# EAGLE design Stearns (EAGLE 6.6.0)
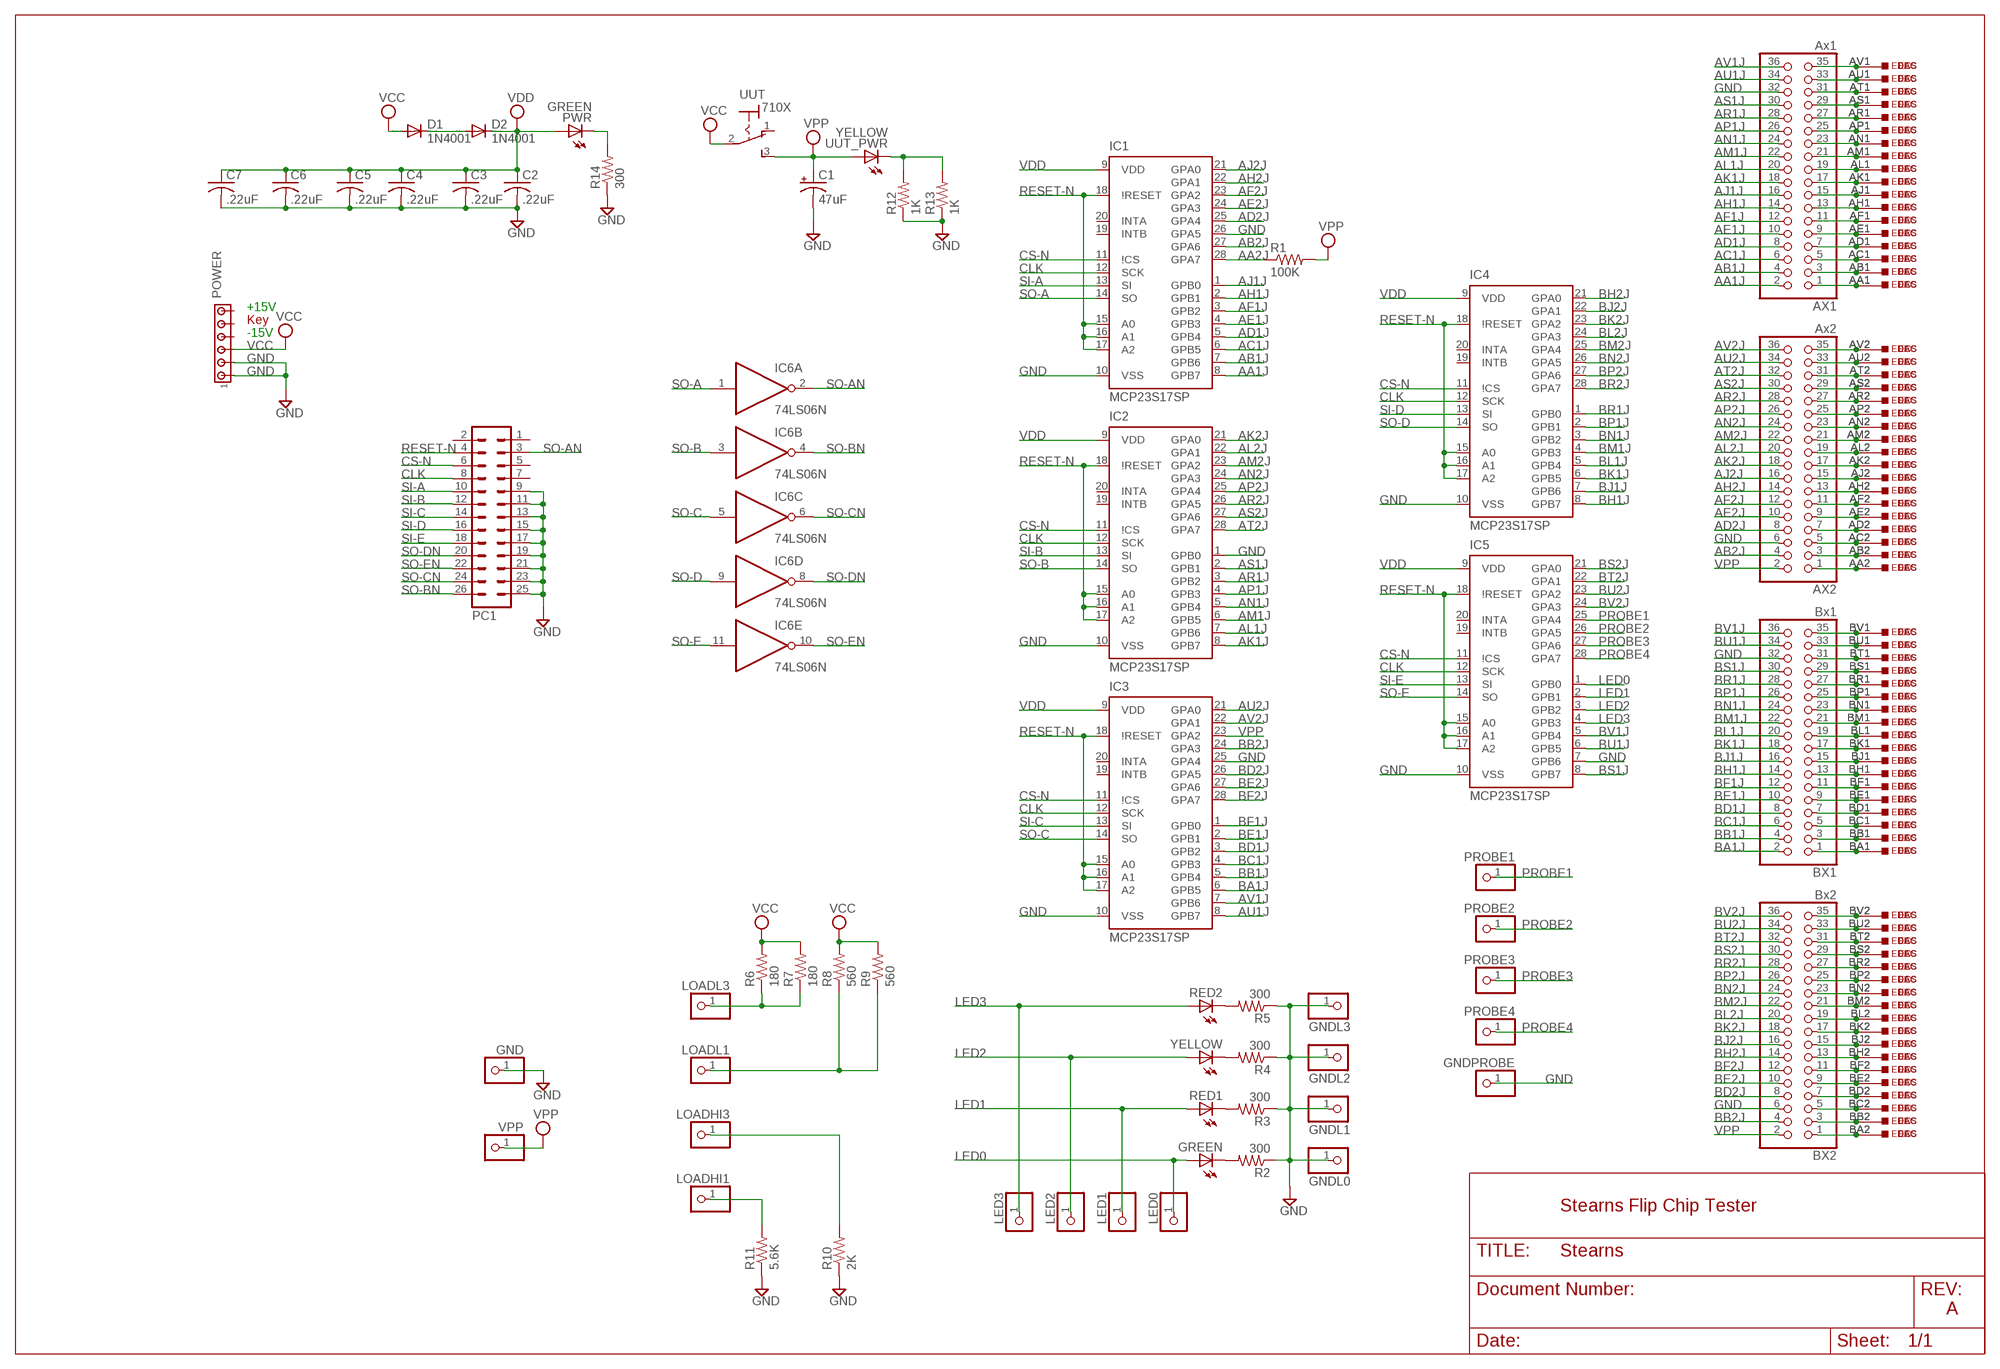
[diagram p0: schematic, sheet 1]

## Parts
AX1  Ax1  PINHD-2X18  [2X18]
AX2  Ax2  PINHD-2X18  [2X18]
BX1  Bx1  PINHD-2X18  [2X18]
BX2  Bx2  PINHD-2X18  [2X18]
C1  47uF  CPOL-USE5-8.5  [E5-8,5]
C2  .22uF  C-US050-025X075  [C050-025X075]
C3  .22uF  C-US050-025X075  [C050-025X075]
C4  .22uF  C-US050-025X075  [C050-025X075]
C5  .22uF  C-US050-025X075  [C050-025X075]
C6  .22uF  C-US050-025X075  [C050-025X075]
C7  .22uF  C-US050-025X075  [C050-025X075]
D1  1N4001  1N4004  [DO41-10]
D2  1N4001  1N4004  [DO41-10]
DEC  W971  [H807-2]
ECS  W971ECS  [ECS2418-2]
EDAC  W971EDAC  [EDAC346-36-2]
GND  PINHD-1X1  [1X01]
GNDL0  PINHD-1X1  [1X01]
GNDL1  PINHD-1X1  [1X01]
GNDL2  PINHD-1X1  [1X01]
GNDL3  PINHD-1X1  [1X01]
GNDPROBE  PINHD-1X1  [1X01]
GREEN  LED5MM  [LED5MM]
IC1  MCP23S17SP  [DIL28-3]
IC2  MCP23S17SP  [DIL28-3]
IC3  MCP23S17SP  [DIL28-3]
IC4  MCP23S17SP  [DIL28-3]
IC5  MCP23S17SP  [DIL28-3]
IC6  74LS06N  [DIL14]
LED0  PINHD-1X1  [1X01]
LED1  PINHD-1X1  [1X01]
LED2  PINHD-1X1  [1X01]
LED3  PINHD-1X1  [1X01]
LOADHI1  PINHD-1X1  [1X01]
LOADHI3  PINHD-1X1  [1X01]
LOADL1  PINHD-1X1  [1X01]
LOADL3  PINHD-1X1  [1X01]
PC1  MA13-2  [MA13-2]
POWER  MTA06-156  [1X6MTA]
PROBE1  PINHD-1X1  [1X01]
PROBE2  PINHD-1X1  [1X01]
PROBE3  PINHD-1X1  [1X01]
PROBE4  PINHD-1X1  [1X01]
PWR  GREEN  LED5MM  [LED5MM]
R1  100K  R-US_0207/10  [0207/10]
R2  300  R-US_0207/10  [0207/10]
R3  300  R-US_0207/10  [0207/10]
R4  300  R-US_0207/10  [0207/10]
R5  300  R-US_0207/10  [0207/10]
R6  180  R-US_0207/10  [0207/10]
R7  180  R-US_0207/10  [0207/10]
R8  560  R-US_0207/10  [0207/10]
R9  560  R-US_0207/10  [0207/10]
R10  2K  R-US_0207/10  [0207/10]
R11  5.6K  R-US_0207/10  [0207/10]
R12  1K  R-US_0207/10  [0207/10]
R13  1K  R-US_0207/10  [0207/10]
R14  300  R-US_0207/10  [0207/10]
RED1  LED5MM  [LED5MM]
RED2  LED5MM  [LED5MM]
UUT  710X  [7109MD9V3]
UUT_PWR  YELLOW  LED5MM  [LED5MM]
VPP  PINHD-1X1  [1X01]
YELLOW  LED5MM  [LED5MM]

## Nets
AA1J: AX1.2 IC1.8(GPB7)
AA2J: IC1.28(GPA7) R1.1
AB1J: AX1.4 IC1.7(GPB6)
AB2J: AX2.4 IC1.27(GPA6)
AC1J: AX1.6 IC1.6(GPB5)
AD1J: AX1.8 IC1.5(GPB4)
AD2J: AX2.8 IC1.25(GPA4)
AE1J: AX1.10 IC1.4(GPB3)
AE2J: AX2.10 IC1.24(GPA3)
AF1J: AX1.12 IC1.3(GPB2)
AF2J: AX2.12 IC1.23(GPA2)
AH1J: AX1.14 IC1.2(GPB1)
AH2J: AX2.14 IC1.22(GPA1)
AJ1J: AX1.16 IC1.1(GPB0)
AJ2J: AX2.16 IC1.21(GPA0)
AK1J: AX1.18 IC2.8(GPB7)
AK2J: AX2.18 IC2.21(GPA0)
AL1J: AX1.20 IC2.7(GPB6)
AL2J: AX2.20 IC2.22(GPA1)
AM1J: AX1.22 IC2.6(GPB5)
AM2J: AX2.22 IC2.23(GPA2)
AN1J: AX1.24 IC2.5(GPB4)
AN2J: AX2.24 IC2.24(GPA3)
AP1J: AX1.26 IC2.4(GPB3)
AP2J: AX2.26 IC2.25(GPA4)
AR1J: AX1.28 IC2.3(GPB2)
AR2J: AX2.28 IC2.26(GPA5)
AS1J: AX1.30 IC2.2(GPB1)
AS2J: AX2.30 IC2.27(GPA6)
AT2J: AX2.32 IC2.28(GPA7)
AU1J: AX1.34 IC3.8(GPB7)
AU2J: AX2.34 IC3.21(GPA0)
AV1J: AX1.36 IC3.7(GPB6)
AV2J: AX2.36 IC3.22(GPA1)
BA1J: BX1.2 IC3.6(GPB5)
BB1J: BX1.4 IC3.5(GPB4)
BB2J: BX2.4 IC3.24(GPA3)
BC1J: BX1.6 IC3.4(GPB3)
BD1J: BX1.8 IC3.3(GPB2)
BD2J: BX2.8 IC3.26(GPA5)
BE1J: BX1.10 IC3.2(GPB1)
BE2J: BX2.10 IC3.27(GPA6)
BF1J: BX1.12 IC3.1(GPB0)
BF2J: BX2.12 IC3.28(GPA7)
BH1J: BX1.14 IC4.8(GPB7)
BH2J: BX2.14 IC4.21(GPA0)
BJ1J: BX1.16 IC4.7(GPB6)
BJ2J: BX2.16 IC4.22(GPA1)
BK1J: BX1.18 IC4.6(GPB5)
BK2J: BX2.18 IC4.23(GPA2)
BL1J: BX1.20 IC4.5(GPB4)
BL2J: BX2.20 IC4.24(GPA3)
BM1J: BX1.22 IC4.4(GPB3)
BM2J: BX2.22 IC4.25(GPA4)
BN1J: BX1.24 IC4.3(GPB2)
BN2J: BX2.24 IC4.26(GPA5)
BP1J: BX1.26 IC4.2(GPB1)
BP2J: BX2.26 IC4.27(GPA6)
BR1J: BX1.28 IC4.1(GPB0)
BR2J: BX2.28 IC4.28(GPA7)
BS1J: BX1.30 IC5.8(GPB7)
BS2J: BX2.30 IC5.21(GPA0)
BT2J: BX2.32 IC5.22(GPA1)
BU1J: BX1.34 IC5.6(GPB5)
BU2J: BX2.34 IC5.23(GPA2)
BV1J: BX1.36 IC5.5(GPB4)
BV2J: BX2.36 IC5.24(GPA3)
CLK: IC1.12(SCK) IC2.12(SCK) IC3.12(SCK) IC4.12(SCK) IC5.12(SCK) PC1.8
CS-N: IC1.11(\!CS) IC2.11(\!CS) IC3.11(\!CS) IC4.11(\!CS) IC5.11(\!CS) PC1.6
GND [Supply]: AX1.32 AX2.6 BX1.32 BX2.6 C1.- C2.2 C3.2 C4.2 C5.2 C6.2 C7.2 GND.1 GNDL0.1 GNDL1.1 GNDL2.1 GNDL3.1 GNDPROBE.1 IC1.10(VSS) IC1.26(GPA5) IC2.1(GPB0) IC2.10(VSS) IC3.10(VSS) IC3.25(GPA4) IC4.10(VSS) IC5.7(GPB6) IC5.10(VSS) PC1.9 PC1.11 PC1.13 PC1.15 PC1.17 PC1.19 PC1.21 PC1.23 PC1.25 POWER.1 POWER.2 R2.1 R3.1 R4.1 R5.1 R10.1 R11.1 R12.1 R13.1 R14.1
LED0: GREEN.A IC5.1(GPB0) LED0.1
LED1: IC5.2(GPB1) LED1.1 RED1.A
LED2: IC5.3(GPB2) LED2.1 YELLOW.A
LED3: IC5.4(GPB3) LED3.1 RED2.A
N$1: AX1.1 DEC.AA1 ECS.AA1 EDAC.AA1
N$2: AX1.35 DEC.AV1 ECS.AV1 EDAC.AV1
N$3: AX1.33 DEC.AU1 ECS.AU1 EDAC.AU1
N$4: AX1.31 DEC.AT1 ECS.AT1 EDAC.AT1
N$5: AX1.29 DEC.AS1 ECS.AS1 EDAC.AS1
N$6: AX1.27 DEC.AR1 ECS.AR1 EDAC.AR1
N$7: AX1.25 DEC.AP1 ECS.AP1 EDAC.AP1
N$8: AX1.23 DEC.AN1 ECS.AN1 EDAC.AN1
N$9: AX1.21 DEC.AM1 ECS.AM1 EDAC.AM1
N$10: AX1.19 DEC.AL1 ECS.AL1 EDAC.AL1
N$11: AX1.17 DEC.AK1 ECS.AK1 EDAC.AK1
N$12: AX1.15 DEC.AJ1 ECS.AJ1 EDAC.AJ1
N$13: AX1.13 DEC.AH1 ECS.AH1 EDAC.AH1
N$14: AX1.11 DEC.AF1 ECS.AF1 EDAC.AF1
N$15: AX1.9 DEC.AE1 ECS.AE1 EDAC.AE1
N$16: AX1.7 DEC.AD1 ECS.AD1 EDAC.AD1
N$17: AX1.5 DEC.AC1 ECS.AC1 EDAC.AC1
N$18: AX1.3 DEC.AB1 ECS.AB1 EDAC.AB1
N$19: AX2.1 DEC.AA2 ECS.AA2 EDAC.AA2
N$20: AX2.3 DEC.AB2 ECS.AB2 EDAC.AB2
N$21: AX2.5 DEC.AC2 ECS.AC2 EDAC.AC2
N$22: AX2.7 DEC.AD2 ECS.AD2 EDAC.AD2
N$23: AX2.9 DEC.AE2 ECS.AE2 EDAC.AE2
N$24: AX2.11 DEC.AF2 ECS.AF2 EDAC.AF2
N$25: AX2.13 DEC.AH2 ECS.AH2 EDAC.AH2
N$26: AX2.15 DEC.AJ2 ECS.AJ2 EDAC.AJ2
N$27: AX2.17 DEC.AK2 ECS.AK2 EDAC.AK2
N$28: AX2.19 DEC.AL2 ECS.AL2 EDAC.AL2
N$29: AX2.21 DEC.AM2 ECS.AM2 EDAC.AM2
N$30: AX2.23 DEC.AN2 ECS.AN2 EDAC.AN2
N$31: AX2.25 DEC.AP2 ECS.AP2 EDAC.AP2
N$32: AX2.27 DEC.AR2 ECS.AR2 EDAC.AR2
N$33: AX2.29 DEC.AS2 ECS.AS2 EDAC.AS2
N$34: AX2.31 DEC.AT2 ECS.AT2 EDAC.AT2
N$35: AX2.33 DEC.AU2 ECS.AU2 EDAC.AU2
N$36: AX2.35 DEC.AV2 ECS.AV2 EDAC.AV2
N$37: BX2.1 DEC.BA2 ECS.BA2 EDAC.BA2
N$38: BX2.3 DEC.BB2 ECS.BB2 EDAC.BB2
N$39: BX2.5 DEC.BC2 ECS.BC2 EDAC.BC2
N$40: BX2.7 DEC.BD2 ECS.BD2 EDAC.BD2
N$41: BX2.9 DEC.BE2 ECS.BE2 EDAC.BE2
N$42: BX2.11 DEC.BF2 ECS.BF2 EDAC.BF2
N$43: BX2.13 DEC.BH2 ECS.BH2 EDAC.BH2
N$44: BX2.15 DEC.BJ2 ECS.BJ2 EDAC.BJ2
N$45: BX2.17 DEC.BK2 ECS.BK2 EDAC.BK2
N$46: BX2.19 DEC.BL2 ECS.BL2 EDAC.BL2
N$47: BX2.21 DEC.BM2 ECS.BM2 EDAC.BM2
N$48: BX2.23 DEC.BN2 ECS.BN2 EDAC.BN2
N$49: BX2.25 DEC.BP2 ECS.BP2 EDAC.BP2
N$50: BX2.27 DEC.BR2 ECS.BR2 EDAC.BR2
N$51: BX2.29 DEC.BS2 ECS.BS2 EDAC.BS2
N$52: BX2.31 DEC.BT2 ECS.BT2 EDAC.BT2
N$53: BX2.33 DEC.BU2 ECS.BU2 EDAC.BU2
N$54: BX2.35 DEC.BV2 ECS.BV2 EDAC.BV2
N$55: BX1.1 DEC.BA1 ECS.BA1 EDAC.BA1
N$56: BX1.3 DEC.BB1 ECS.BB1 EDAC.BB1
N$57: BX1.5 DEC.BC1 ECS.BC1 EDAC.BC1
N$58: BX1.7 DEC.BD1 ECS.BD1 EDAC.BD1
N$59: BX1.9 DEC.BE1 ECS.BE1 EDAC.BE1
N$60: BX1.11 DEC.BF1 ECS.BF1 EDAC.BF1
N$61: BX1.13 DEC.BH1 ECS.BH1 EDAC.BH1
N$62: BX1.15 DEC.BJ1 ECS.BJ1 EDAC.BJ1
N$63: BX1.17 DEC.BK1 ECS.BK1 EDAC.BK1
N$64: BX1.19 DEC.BL1 ECS.BL1 EDAC.BL1
N$65: BX1.21 DEC.BM1 ECS.BM1 EDAC.BM1
N$66: BX1.23 DEC.BN1 ECS.BN1 EDAC.BN1
N$67: BX1.25 DEC.BP1 ECS.BP1 EDAC.BP1
N$68: BX1.27 DEC.BR1 ECS.BR1 EDAC.BR1
N$69: BX1.29 DEC.BS1 ECS.BS1 EDAC.BS1
N$70: BX1.31 DEC.BT1 ECS.BT1 EDAC.BT1
N$71: BX1.33 DEC.BU1 ECS.BU1 EDAC.BU1
N$72: BX1.35 DEC.BV1 ECS.BV1 EDAC.BV1
N$73: GREEN.K(C) R2.2
N$74: R3.2 RED1.K(C)
N$75: R4.2 YELLOW.K(C)
N$76: R5.2 RED2.K(C)
N$77: LOADL3.1 R6.1 R7.1
N$78: LOADL1.1 R8.1 R9.1
N$79: LOADHI1.1 R11.2
N$80: LOADHI3.1 R10.2
N$81: D1.C D2.A
N$82: R12.2 R13.2 UUT_PWR.K(C)
N$83: PWR.K(C) R14.2
PROBE1: IC5.25(GPA4) PROBE1.1
PROBE2: IC5.26(GPA5) PROBE2.1
PROBE3: IC5.27(GPA6) PROBE3.1
PROBE4: IC5.28(GPA7) PROBE4.1
RESET-N: IC1.15(A0) IC1.16(A1) IC1.17(A2) IC1.18(\!RESET) IC2.15(A0) IC2.16(A1) IC2.17(A2) IC2.18(\!RESET) IC3.15(A0) IC3.16(A1) IC3.17(A2) IC3.18(\!RESET) IC4.15(A0) IC4.16(A1) IC4.17(A2) IC4.18(\!RESET) IC5.15(A0) IC5.16(A1) IC5.17(A2) IC5.18(\!RESET) PC1.4
SI-A: IC1.13(SI) PC1.10
SI-B: IC2.13(SI) PC1.12
SI-C: IC3.13(SI) PC1.14
SI-D: IC4.13(SI) PC1.16
SI-E: IC5.13(SI) PC1.18
SO-A: IC1.14(SO) IC6.1(A:I)
SO-AN: IC6.2(A:O) PC1.3
SO-B: IC2.14(SO) IC6.3(B:I)
SO-BN: IC6.4(B:O) PC1.26
SO-C: IC3.14(SO) IC6.5(C:I)
SO-CN: IC6.6(C:O) PC1.24
SO-D: IC4.14(SO) IC6.9(D:I)
SO-DN: IC6.8(D:O) PC1.20
SO-E: IC5.14(SO) IC6.11(E:I)
SO-EN: IC6.10(E:O) PC1.22
VCC [Supply]: D1.A POWER.3 R6.2 R7.2 R8.2 R9.2 UUT.2(P)
VDD [Supply]: C2.1 C3.1 C4.1 C5.1 C6.1 C7.1 D2.C IC1.9(VDD) IC2.9(VDD) IC3.9(VDD) IC4.9(VDD) IC5.9(VDD) PWR.A
VPP [Supply]: AX2.2 BX2.2 C1.+ IC3.23(GPA2) R1.2 UUT.3(S) UUT_PWR.A VPP.1
Unconnected: IC1.19(INTB) IC1.20(INTA) IC2.19(INTB) IC2.20(INTA) IC3.19(INTB) IC3.20(INTA) IC4.19(INTB) IC4.20(INTA) IC5.19(INTB) IC5.20(INTA) IC6.12(F:O) IC6.13(F:I) PC1.1 PC1.2 PC1.5 PC1.7 POWER.4 POWER.5 POWER.6 UUT.1(O)

## Notes on the sheet
- +15V
- Key
- -15V
- Stearns Flip Chip Tester
- A

## Power pins joined to a net without a drawn wire
GND: IC6.7(P:GND) UUT.NC@1(GND) UUT.NC@2(GND) UUT.NC@3(GND) UUT.NC@4(GND) UUT.NC@5(GND) UUT.NC@6(GND) UUT.NC@7(GND) UUT.NC@8(GND)
VCC: IC6.14(P:VCC)

## Library data of the parts
AX1 AX2 BX1 BX2 = pinhead:PINHD-2X18: PIN HEADER
C1 = rcl:CPOL-US: POLARIZED CAPACITOR, American symbol
C2-C7 = rcl:C-US: CAPACITOR, American symbol
D1 D2 = diode:1N4004: DIODE general purpose rectifier, 1 A
DEC ECS EDAC = dec-m:W971: Double sided Double Height Connector, 72 pins
GND GNDL0 GNDL1-GNDL3 GNDPROBE LED0 LED1-LED3 LOADHI1 LOADHI3 LOADL1 LOADL3 PROBE1-PROBE4 VPP = pinhead:PINHD-1X1: PIN HEADER
GREEN PWR RED1 RED2 UUT_PWR YELLOW = led:LED: LED OSRAM: - CHIPLED LG R971, LG N971, LY N971, LG Q971, LY Q971, LO R971, LY R971 LH N974, LH R974 LS Q976, LO Q976, LY Q976 LO Q996 - Hyper CHIPLED LW Q18S LB Q993, LB Q99A, LB R99A - SideLED LS A670, LO A670, LY A670, LG A670, LP A670 LB A673, LV A673, LT A673, LW A673 LH A674 LY A675 LS A676, LA A676, LO A676, LY A676, LW A676 LS A679, LY A679, LG A679 - Hyper Micro SIDELED® LS Y876, LA Y876, LO Y876, LY Y876 LT Y87S - SmartLED LW L88C, LW L88S LB L89C, LB L89S, LG L890 LS L89K, LO L89K, LY L89K LS L896, LA L896, LO L896, LY L896 - TOPLED LS T670, LO T670, LY T670, LG T670, LP T670 LSG T670, LSP T670, LSY T670, LOP T670, LYG T670 LG T671, LOG T671, LSG T671 LB T673, LV T673, LT T673, LW T673 LH T674 LS T676, LA T676, LO T676, LY T676, LB T676, LH T676, LSB T676, LW T676 LB T67C, LV T67C, LT T67C, LS T67K, LO T67K, LY T67K, LW E67C LS E67B, LA E67B, LO E67B, LY E67B, LB E67C, LV E67C, LT E67C LW T67C LS T679, LY T679, LG T679 LS T770, LO T770, LY T770, LG T770, LP T770 LB T773, LV T773, LT T773, LW T773 LH T774 LS E675, LA E675, LY E675, LS T675 LS T776, LA T776, LO T776, LY T776, LB T776 LHGB T686 LT T68C, LB T68C - Hyper Mini TOPLED® LB M676 - Mini TOPLED Santana® LG M470 LS M47K, LO M47K, LY M47K Source: http://www.osram.convergy.de LUXEON: - LUMILED® LXK2-PW12-R00, LXK2-PW12-S00, LXK2-PW14-U00, LXK2-PW14-V00 LXK2-PM12-R00, LXK2-PM12-S00, LXK2-PM14-U00 LXK2-PE12-Q00, LXK2-PE12-R00, LXK2-PE12-S00, LXK2-PE14-T00, LXK2-PE14-U00 LXK2-PB12-K00, LXK2-PB12-L00, LXK2-PB12-M00, LXK2-PB14-N00, LXK2-PB14-P00, LXK2-PB14-Q00 LXK2-PR12-L00, LXK2-PR12-M00, LXK2-PR14-Q00, LXK2-PR14-R00 LXK2-PD12-Q00, LXK2-PD12-R00, LXK2-PD12-S00 LXK2-PH12-R00, LXK2-PH12-S00 LXK2-PL12-P00, LXK2-PL12-Q00, LXK2-PL12-R00 Source: www.luxeon.com KINGBRIGHT: KA-3528ASYC Source: www.kingbright.com
IC1-IC5 = MCP23S17:MCP23S17: http://ww1.microchip.com/downloads/en/DeviceDoc/21952a.pdf Source: http://ww1.microchip.com/downloads/en/DeviceDoc/21952a.pdf
IC6 = 74xx-us:74*06: Hex INVERTER, open collector high-voltage output
PC1 = con-lstb:MA13-2: PIN HEADER; OC_FARNELL: unknown; OC_NEWARK: unknown
POWER = con-amp:MTA06-156: AMP connector
R1-R14 = rcl:R-US_: RESISTOR, American symbol
UUT = dec-con:710X: 710x with optional V2 or V3 mounting bracket.

## Net classes
1 Supply: width 0.813 mm

## Board
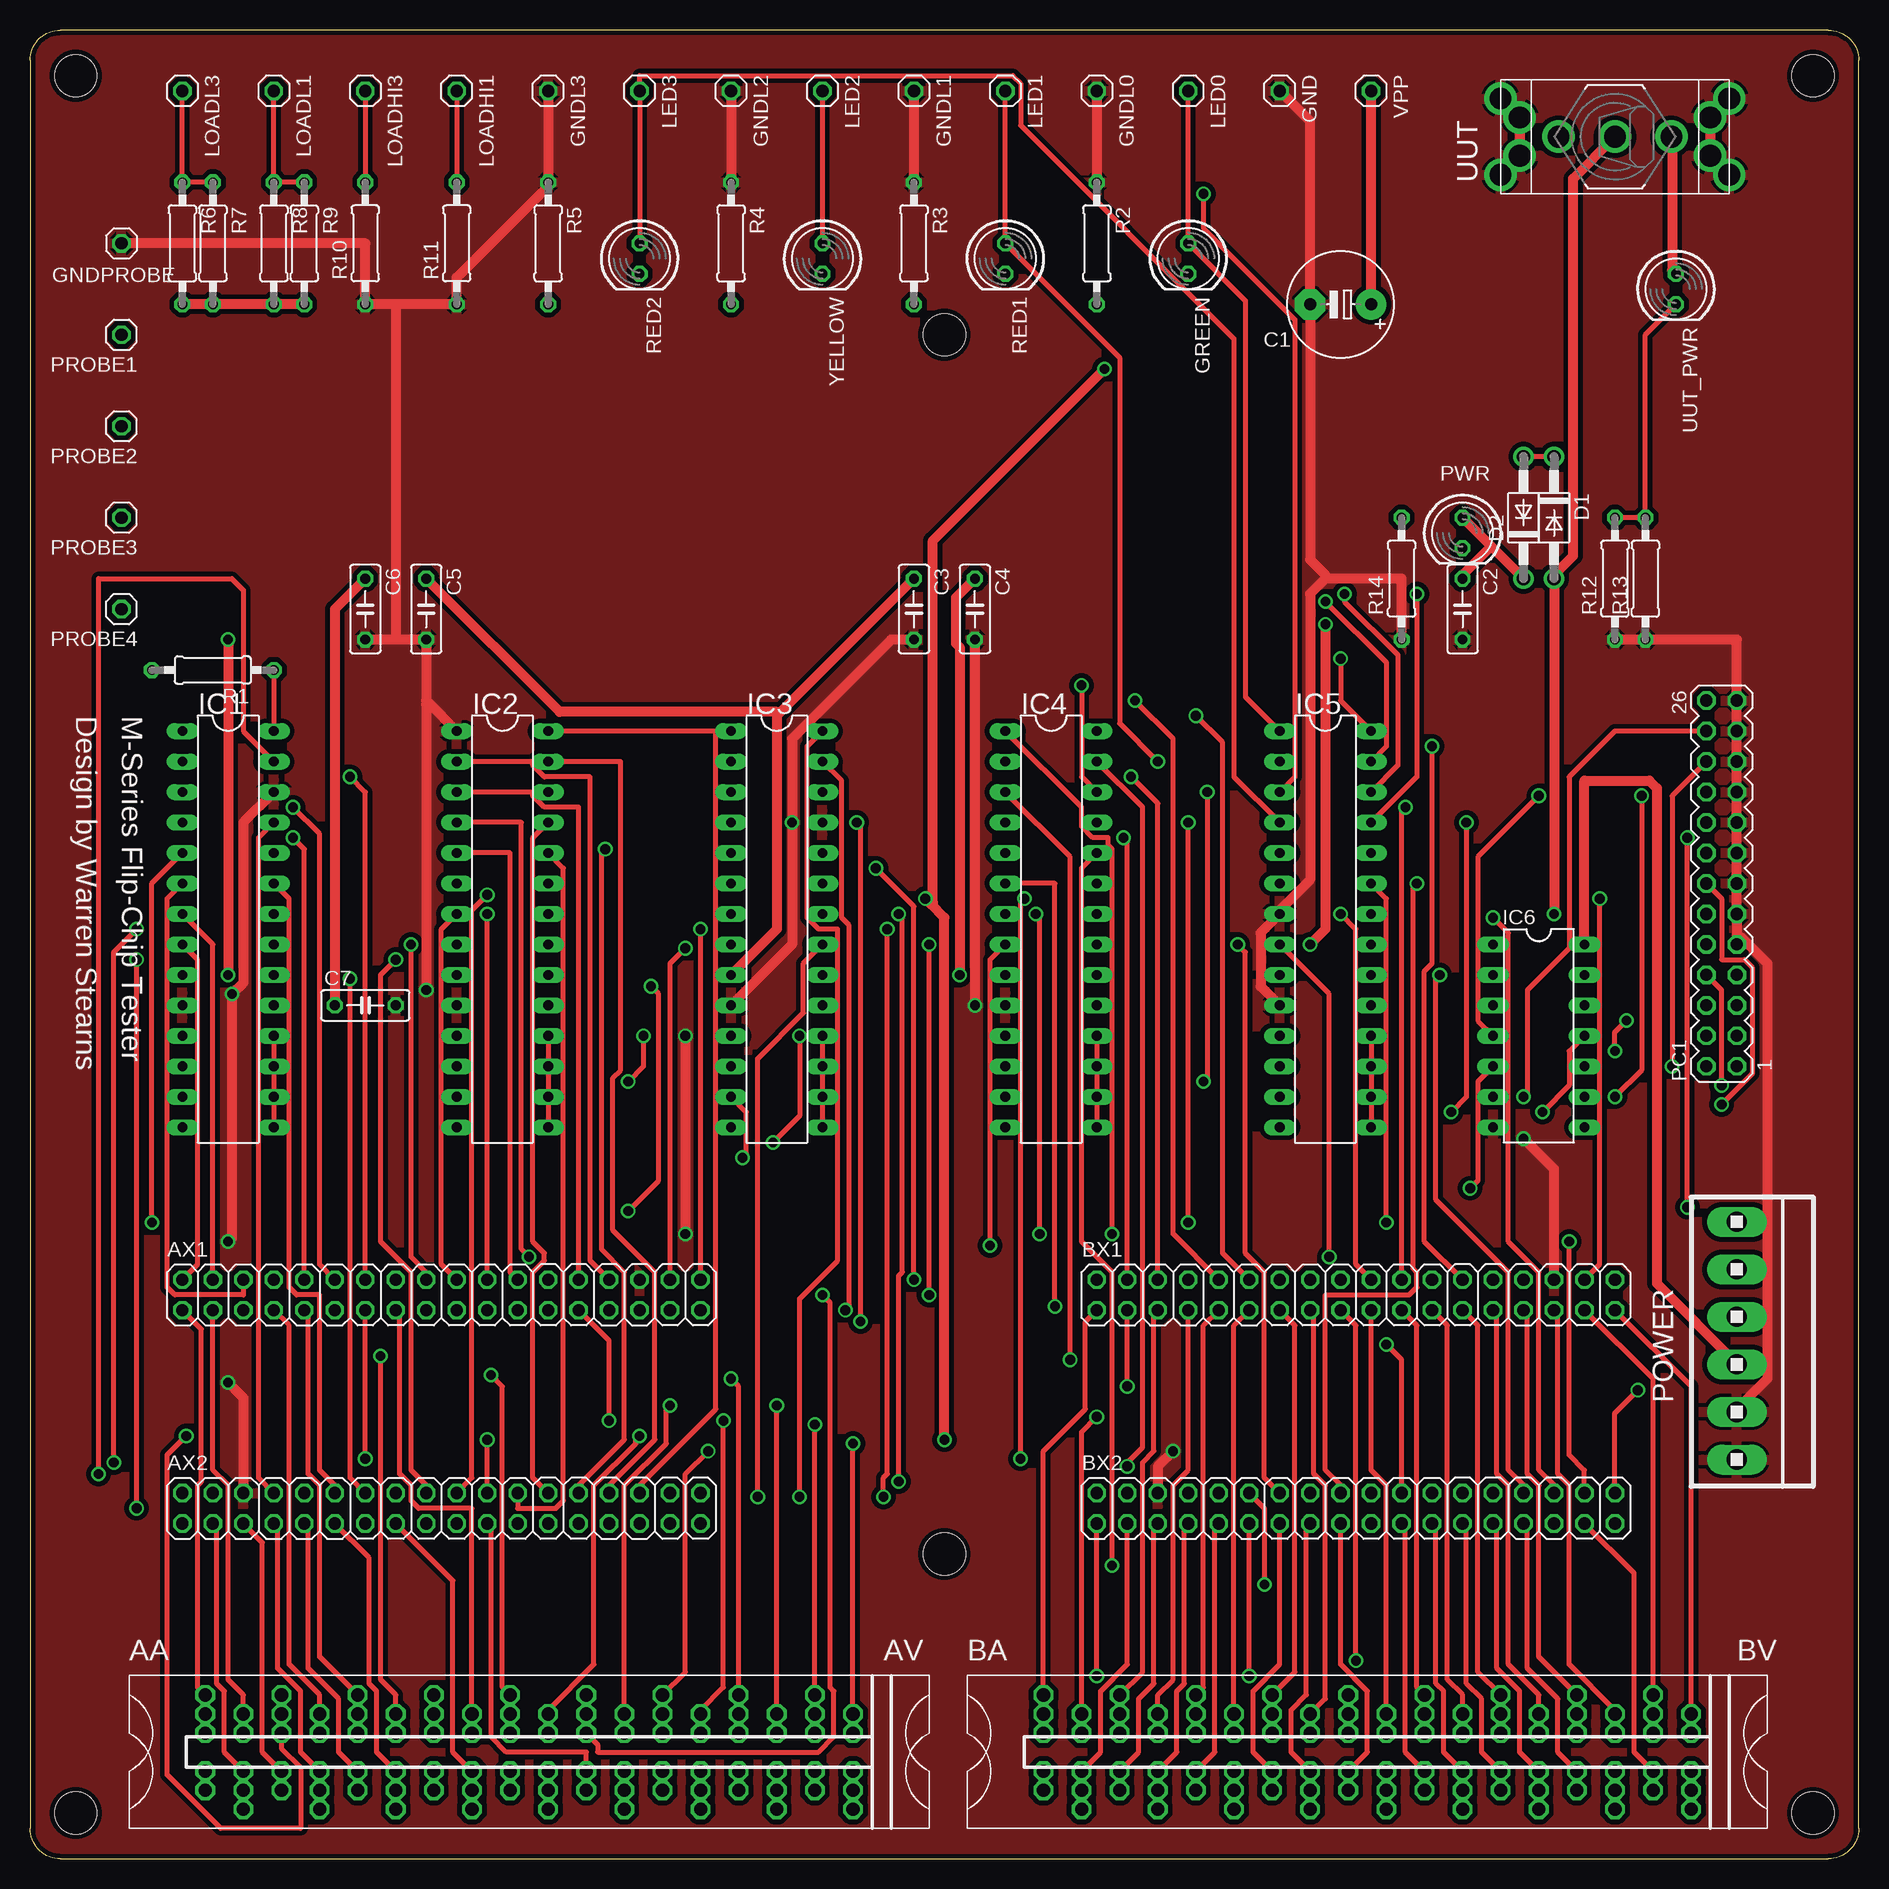
[diagram p1: board, top side]
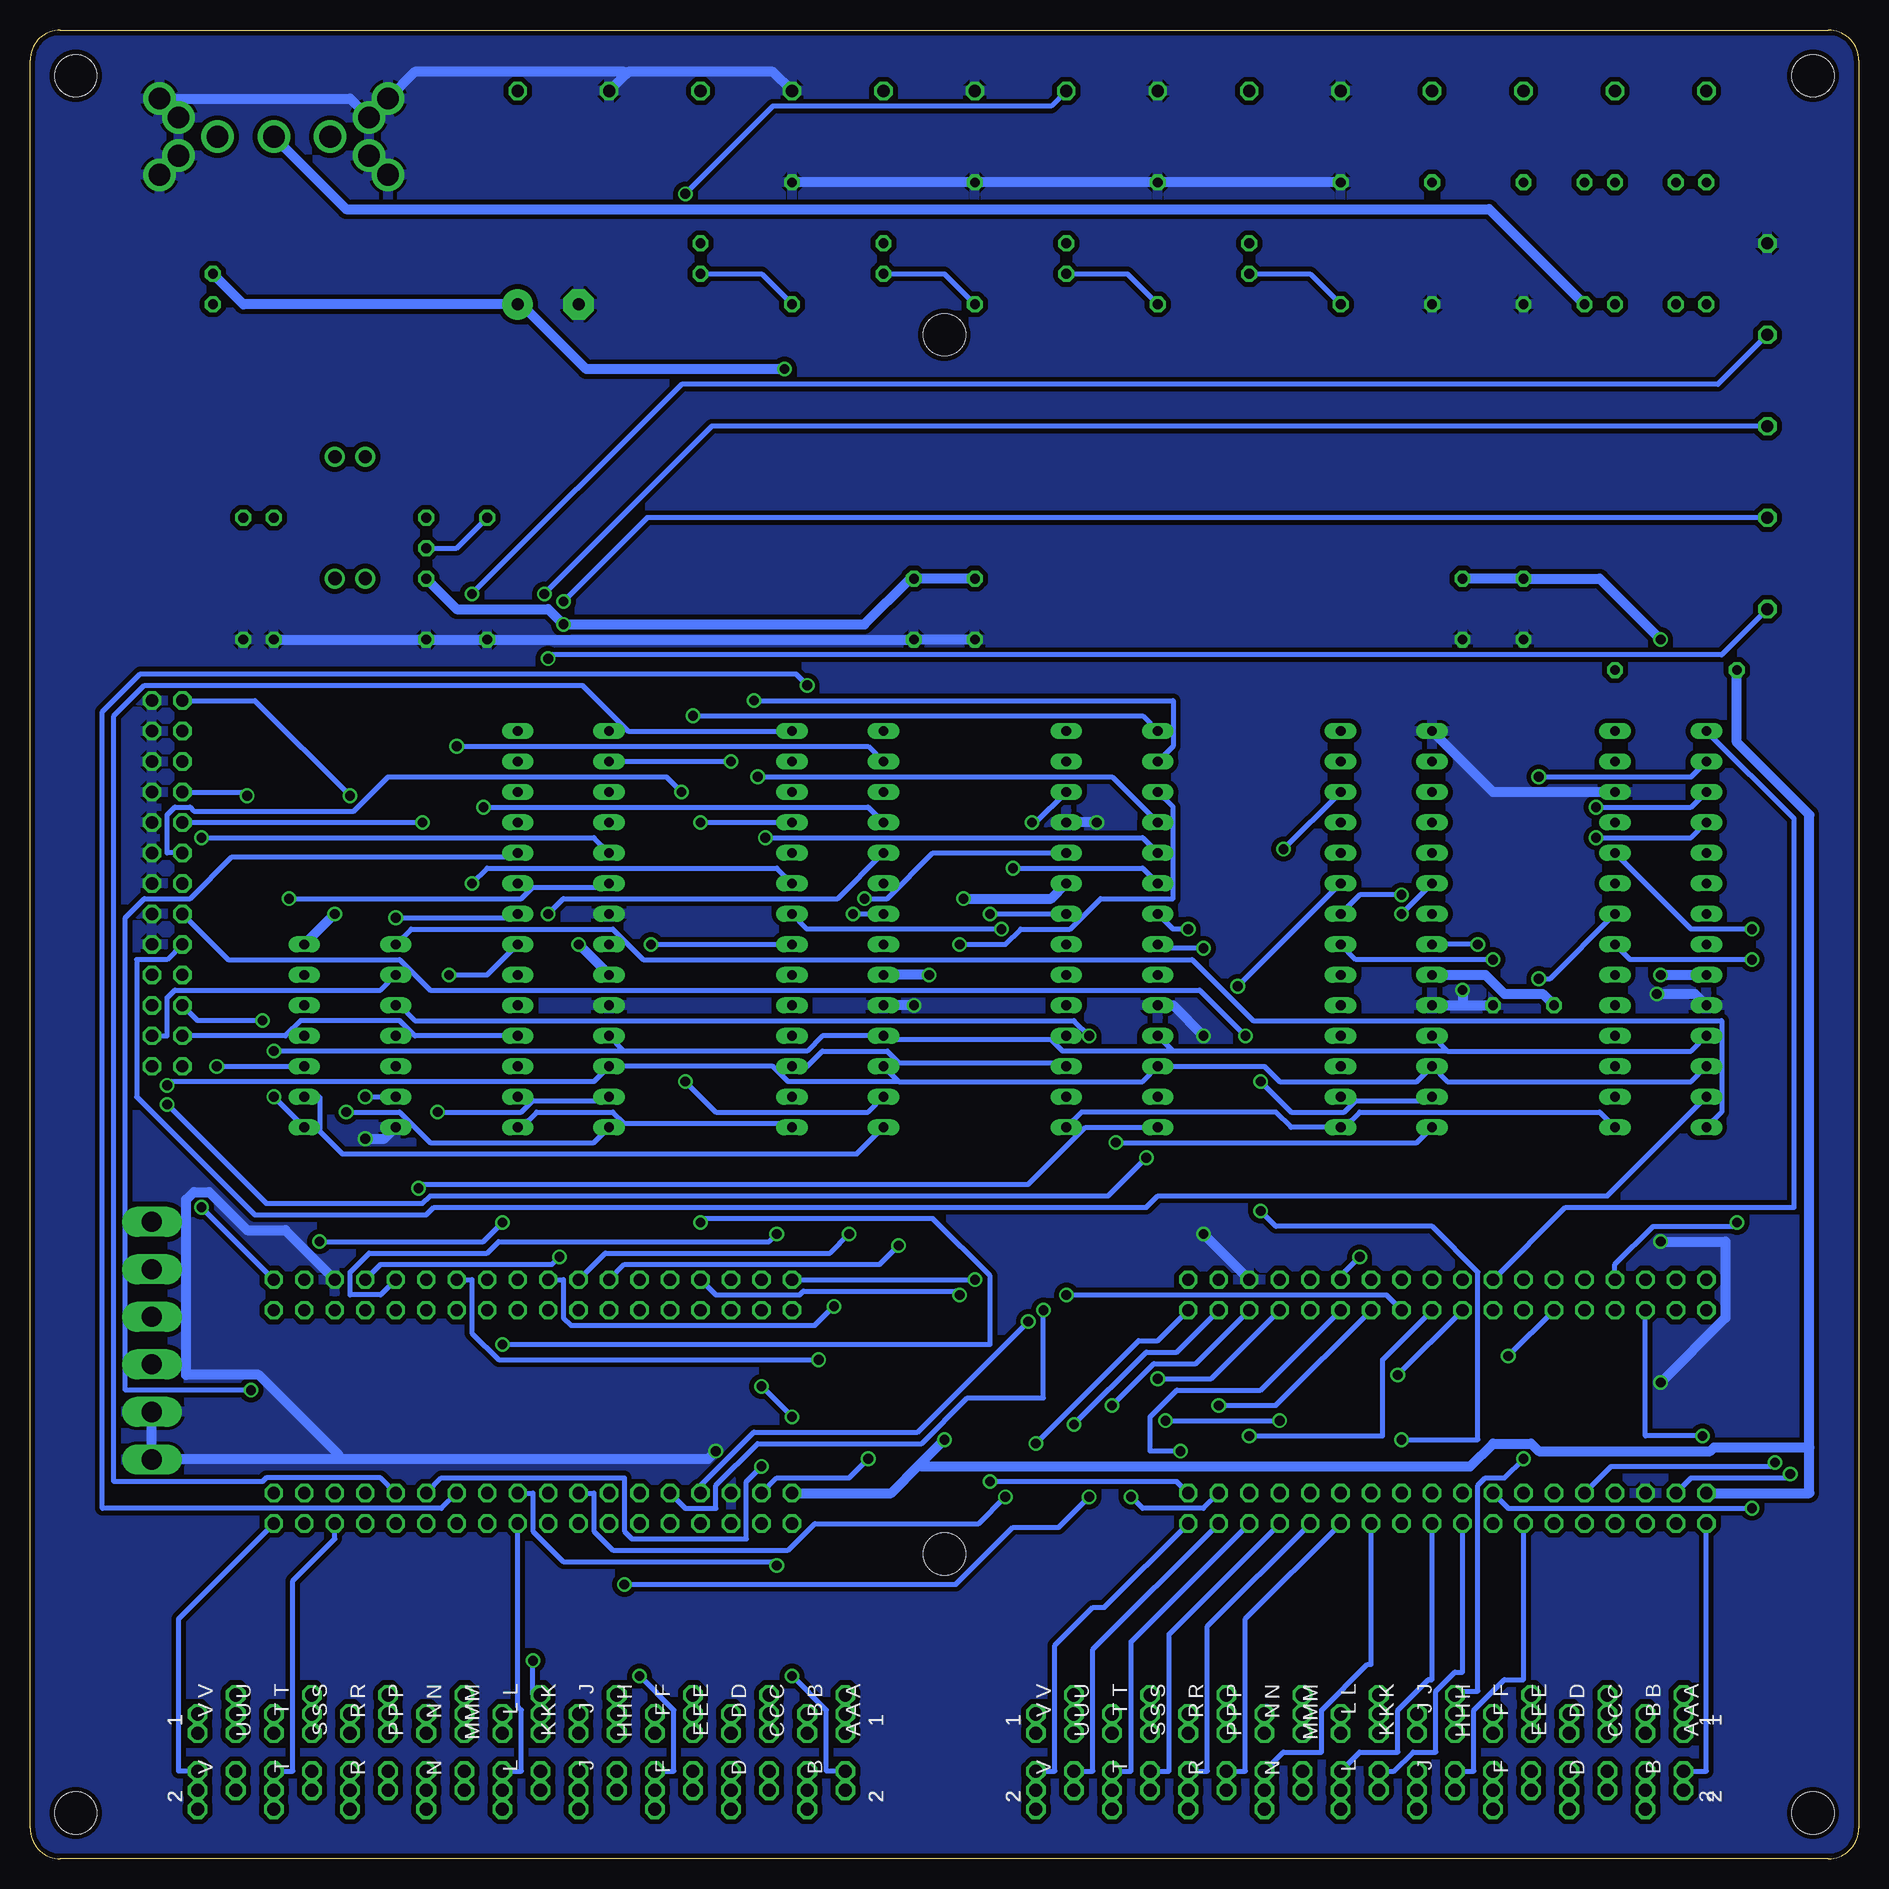
[diagram p2: board, bottom side, seen from below]

Size 152.4 x 152.4 mm. Coordinates in mm from the lower left corner, seen from the top.
Outline: 2.54,0 149.86,0 arc90 152.4,2.54 152.4,149.86 arc90 149.86,152.4 2.54,152.4 arc90 0,149.86 0,2.54 arc90 2.54,0
Copper layers (1+16): Top 0.035mm / dielectric 1.5mm / Bottom 0.035mm
Design rules "16mils *": minimum track width 16mil, minimum drill 32mil, track to track 15mil, track to pad 10mil, pad to pad 10mil, via to via 10mil, smd to smd 10mil, copper to edge 13mil, drill to drill 10mil, minimum pad ring 10mil, minimum via ring 8mil, stop-mask expansion 0mil, vias tented up to drill 0mil, thermal gap 10mil
Holes 3.51 mm at 3.81,3.81 148.59,3.81 148.59,148.59 3.81,148.59 76.2,25.4 76.2,127

### Footprints (pad centres in the part's own frame; a part is rotated, then mirrored left to right if it is on the bottom)
2X18 = drill 1.016 octagon: 1 -21.59,-1.27; 2 -21.59,1.27; 3 -19.05,-1.27; 4 -19.05,1.27; 5 -16.51,-1.27; 6 -16.51,1.27; 7 -13.97,-1.27; 8 -13.97,1.27; 9 -11.43,-1.27; 10 -11.43,1.27; 11 -8.89,-1.27; 12 -8.89,1.27; 13 -6.35,-1.27; 14 -6.35,1.27; 15 -3.81,-1.27; 16 -3.81,1.27; 17 -1.27,-1.27; 18 -1.27,1.27; 19 1.27,-1.27; 20 1.27,1.27; 21 3.81,-1.27; 22 3.81,1.27; 23 6.35,-1.27; 24 6.35,1.27; 25 8.89,-1.27; 26 8.89,1.27; 27 11.43,-1.27; 28 11.43,1.27; 29 13.97,-1.27; 30 13.97,1.27; 31 16.51,-1.27; 32 16.51,1.27; 33 19.05,-1.27; 34 19.05,1.27; 35 21.59,-1.27; 36 21.59,1.27
E5-8,5 = drill 1.016 pad 2.54: + -2.54,0 | drill 1.016 pad 2.54 octagon: - 2.54,0
C050-025X075 = drill 0.813 octagon: 1 -2.54,0; 2 2.54,0
DO41-10 = drill 1.118: A 5.08,0; C -5.08,0
H807-2 = drill 1.092 octagon: AA1 4.763,60.325; AA2 -1.587,60.325; AB1 1.587,57.15; AB2 -4.763,57.15; AC1 4.763,53.975; AC2 -1.587,53.975; AD1 1.587,50.8; AD2 -4.763,50.8; AE1 4.763,47.625; AE2 -1.587,47.625; AF1 1.587,44.45; AF2 -4.763,44.45; AH1 4.763,41.275; AH2 -1.587,41.275; AJ1 1.587,38.1; AJ2 -4.763,38.1; AK1 4.763,34.925; AK2 -1.587,34.925; AL1 1.587,31.75; AL2 -4.763,31.75; AM1 4.763,28.575; AM2 -1.587,28.575; AN1 1.587,25.4; AN2 -4.763,25.4; AP1 4.763,22.225; AP2 -1.587,22.225; AR1 1.587,19.05; AR2 -4.763,19.05; AS1 4.763,15.875; AS2 -1.587,15.875; AT1 1.587,12.7; AT2 -4.763,12.7; AU1 4.763,9.525; AU2 -1.587,9.525; AV1 1.587,6.35; AV2 -4.763,6.35; BA1 4.763,-9.525; BA2 -1.587,-9.525; BB1 1.587,-12.7; BB2 -4.763,-12.7; BC1 4.763,-15.875; BC2 -1.587,-15.875; BD1 1.587,-19.05; BD2 -4.763,-19.05; BE1 4.763,-22.225; BE2 -1.587,-22.225; BF1 1.587,-25.4; BF2 -4.763,-25.4; BH1 4.763,-28.575; BH2 -1.587,-28.575; BJ1 1.587,-31.75; BJ2 -4.763,-31.75; BK1 4.763,-34.925; BK2 -1.587,-34.925; BL1 1.587,-38.1; BL2 -4.763,-38.1; BM1 4.763,-41.275; BM2 -1.587,-41.275; BN1 1.587,-44.45; BN2 -4.763,-44.45; BP1 4.763,-47.625; BP2 -1.587,-47.625; BR1 1.587,-50.8; BR2 -4.763,-50.8; BS1 4.763,-53.975; BS2 -1.587,-53.975; BT1 1.587,-57.15; BT2 -4.763,-57.15; BU1 4.763,-60.325; BU2 -1.587,-60.325; BV1 1.587,-63.5; BV2 -4.763,-63.5
ECS2418-2 = drill 1.092 octagon: AA1 1.587,60.325; AA2 -1.587,60.325; AB1 1.587,57.15; AB2 -1.587,57.15; AC1 1.587,53.975; AC2 -1.587,53.975; AD1 1.587,50.8; AD2 -1.587,50.8; AE1 1.587,47.625; AE2 -1.587,47.625; AF1 1.587,44.45; AF2 -1.587,44.45; AH1 1.587,41.275; AH2 -1.587,41.275; AJ1 1.587,38.1; AJ2 -1.587,38.1; AK1 1.587,34.925; AK2 -1.587,34.925; AL1 1.587,31.75; AL2 -1.587,31.75; AM1 1.587,28.575; AM2 -1.587,28.575; AN1 1.587,25.4; AN2 -1.587,25.4; AP1 1.587,22.225; AP2 -1.587,22.225; AR1 1.587,19.05; AR2 -1.587,19.05; AS1 1.587,15.875; AS2 -1.587,15.875; AT1 1.587,12.7; AT2 -1.587,12.7; AU1 1.587,9.525; AU2 -1.587,9.525; AV1 1.587,6.35; AV2 -1.587,6.35; BA1 1.587,-9.525; BA2 -1.587,-9.525; BB1 1.587,-12.7; BB2 -1.587,-12.7; BC1 1.587,-15.875; BC2 -1.587,-15.875; BD1 1.587,-19.05; BD2 -1.587,-19.05; BE1 1.587,-22.225; BE2 -1.587,-22.225; BF1 1.587,-25.4; BF2 -1.587,-25.4; BH1 1.587,-28.575; BH2 -1.587,-28.575; BJ1 1.587,-31.75; BJ2 -1.587,-31.75; BK1 1.587,-34.925; BK2 -1.587,-34.925; BL1 1.587,-38.1; BL2 -1.587,-38.1; BM1 1.587,-41.275; BM2 -1.587,-41.275; BN1 1.587,-44.45; BN2 -1.587,-44.45; BP1 1.587,-47.625; BP2 -1.587,-47.625; BR1 1.587,-50.8; BR2 -1.587,-50.8; BS1 1.587,-53.975; BS2 -1.587,-53.975; BT1 1.587,-57.15; BT2 -1.587,-57.15; BU1 1.587,-60.325; BU2 -1.587,-60.325; BV1 1.587,-63.5; BV2 -1.587,-63.5
EDAC346-36-2 = drill 1.092 octagon: AA1 3.175,60.325; AA2 -3.175,60.325; AB1 3.175,57.15; AB2 -3.175,57.15; AC1 3.175,53.975; AC2 -3.175,53.975; AD1 3.175,50.8; AD2 -3.175,50.8; AE1 3.175,47.625; AE2 -3.175,47.625; AF1 3.175,44.45; AF2 -3.175,44.45; AH1 3.175,41.275; AH2 -3.175,41.275; AJ1 3.175,38.1; AJ2 -3.175,38.1; AK1 3.175,34.925; AK2 -3.175,34.925; AL1 3.175,31.75; AL2 -3.175,31.75; AM1 3.175,28.575; AM2 -3.175,28.575; AN1 3.175,25.4; AN2 -3.175,25.4; AP1 3.175,22.225; AP2 -3.175,22.225; AR1 3.175,19.05; AR2 -3.175,19.05; AS1 3.175,15.875; AS2 -3.175,15.875; AT1 3.175,12.7; AT2 -3.175,12.7; AU1 3.175,9.525; AU2 -3.175,9.525; AV1 3.175,6.35; AV2 -3.175,6.35; BA1 3.175,-9.525; BA2 -3.175,-9.525; BB1 3.175,-12.7; BB2 -3.175,-12.7; BC1 3.175,-15.875; BC2 -3.175,-15.875; BD1 3.175,-19.05; BD2 -3.175,-19.05; BE1 3.175,-22.225; BE2 -3.175,-22.225; BF1 3.175,-25.4; BF2 -3.175,-25.4; BH1 3.175,-28.575; BH2 -3.175,-28.575; BJ1 3.175,-31.75; BJ2 -3.175,-31.75; BK1 3.175,-34.925; BK2 -3.175,-34.925; BL1 3.175,-38.1; BL2 -3.175,-38.1; BM1 3.175,-41.275; BM2 -3.175,-41.275; BN1 3.175,-44.45; BN2 -3.175,-44.45; BP1 3.175,-47.625; BP2 -3.175,-47.625; BR1 3.175,-50.8; BR2 -3.175,-50.8; BS1 3.175,-53.975; BS2 -3.175,-53.975; BT1 3.175,-57.15; BT2 -3.175,-57.15; BU1 3.175,-60.325; BU2 -3.175,-60.325; BV1 3.175,-63.5; BV2 -3.175,-63.5
1X01 = drill 1.016 octagon: 1 0,0
LED5MM = drill 0.813 octagon: A -1.27,0; K 1.27,0
DIL28-3 = drill 0.813 long: 1 -16.51,-3.81; 2 -13.97,-3.81; 3 -11.43,-3.81; 4 -8.89,-3.81; 5 -6.35,-3.81; 6 -3.81,-3.81; 7 -1.27,-3.81; 8 1.27,-3.81; 9 3.81,-3.81; 10 6.35,-3.81; 11 8.89,-3.81; 12 11.43,-3.81; 13 13.97,-3.81; 14 16.51,-3.81; 15 16.51,3.81; 16 13.97,3.81; 17 11.43,3.81; 18 8.89,3.81; 19 6.35,3.81; 20 3.81,3.81; 21 1.27,3.81; 22 -1.27,3.81; 23 -3.81,3.81; 24 -6.35,3.81; 25 -8.89,3.81; 26 -11.43,3.81; 27 -13.97,3.81; 28 -16.51,3.81
DIL14 = drill 0.813 long: 1 -7.62,-3.81; 2 -5.08,-3.81; 3 -2.54,-3.81; 4 0,-3.81; 5 2.54,-3.81; 6 5.08,-3.81; 7 7.62,-3.81; 8 7.62,3.81; 9 5.08,3.81; 10 2.54,3.81; 11 0,3.81; 12 -2.54,3.81; 13 -5.08,3.81; 14 -7.62,3.81
MA13-2 = drill 1.016 octagon: 1 -15.24,-1.27; 2 -15.24,1.27; 3 -12.7,-1.27; 4 -12.7,1.27; 5 -10.16,-1.27; 6 -10.16,1.27; 7 -7.62,-1.27; 8 -7.62,1.27; 9 -5.08,-1.27; 10 -5.08,1.27; 11 -2.54,-1.27; 12 -2.54,1.27; 13 0,-1.27; 14 0,1.27; 15 2.54,-1.27; 16 2.54,1.27; 17 5.08,-1.27; 18 5.08,1.27; 19 7.62,-1.27; 20 7.62,1.27; 21 10.16,-1.27; 22 10.16,1.27; 23 12.7,-1.27; 24 12.7,1.27; 25 15.24,-1.27; 26 15.24,1.27
1X6MTA = drill 1.676 long: 1 9.906,0; 2 5.944,0; 3 1.981,0; 4 -1.981,0; 5 -5.944,0; 6 -9.906,0
0207/10 = drill 0.813 octagon: 1 -5.08,0; 2 5.08,0
7109MD9V3 = drill 1.803: 1 0,4.699; 2 0,0; 3 0,-4.699; NC@1 -3.175,9.525; NC@2 -1.587,7.938; NC@3 3.175,9.525; NC@4 1.587,7.938; NC@5 -3.175,-9.525; NC@6 -1.587,-7.938; NC@7 1.587,-7.938; NC@8 3.175,-9.525

### Placement (x,y rotation side)
AX1  34.29,46.99 0 top
AX2  34.29,29.21 0 top
BX1  110.49,46.99 0 top
BX2  110.49,29.21 0 top
C1  109.22,129.54 180 top
C2  119.38,104.14 270 top
C3  73.66,104.14 270 top
C4  78.74,104.14 270 top
C5  33.02,104.14 270 top
C6  27.94,104.14 270 top
C7  27.94,71.12 0 top
D1  127,111.76 270 top
D2  124.46,111.76 90 top
DEC  74.93,8.89 90 top
ECS  74.93,8.89 90 top
EDAC  74.93,8.89 90 top
GND  104.14,147.32 270 top
GNDL0  88.9,147.32 270 top
GNDL1  73.66,147.32 270 top
GNDL2  58.42,147.32 270 top
GNDL3  43.18,147.32 270 top
GNDPROBE  7.62,134.62 0 top
GREEN  96.52,133.35 270 top
IC1  16.51,77.47 270 top
IC2  39.37,77.47 270 top
IC3  62.23,77.47 270 top
IC4  85.09,77.47 270 top
IC5  107.95,77.47 270 top
IC6  125.73,68.58 270 top
LED0  96.52,147.32 270 top
LED1  81.28,147.32 270 top
LED2  66.04,147.32 270 top
LED3  50.8,147.32 270 top
LOADHI1  35.56,147.32 270 top
LOADHI3  27.94,147.32 270 top
LOADL1  20.32,147.32 270 top
LOADL3  12.7,147.32 270 top
PC1  140.97,81.28 90 top
POWER  142.24,43.18 270 top
PROBE1  7.62,127 180 top
PROBE2  7.62,119.38 180 top
PROBE3  7.62,111.76 180 top
PROBE4  7.62,104.14 180 top
PWR  119.38,110.49 270 top
R1  15.24,99.06 180 top
R2  88.9,134.62 270 top
R3  73.66,134.62 270 top
R4  58.42,134.62 270 top
R5  43.18,134.62 270 top
R6  12.7,134.62 270 top
R7  15.24,134.62 270 top
R8  20.32,134.62 270 top
R9  22.86,134.62 270 top
R10  27.94,134.62 90 top
R11  35.56,134.62 90 top
R12  132.08,106.68 90 top
R13  134.62,106.68 90 top
R14  114.3,106.68 90 top
RED1  81.28,133.35 270 top
RED2  50.8,133.35 270 top
UUT  132.08,143.51 90 top
UUT_PWR  137.16,130.81 270 top
VPP  111.76,147.32 270 top
YELLOW  66.04,133.35 270 top

### Tracks (layer width: path | path; a pad name or v marks a point on that pad's centre or on a via)
AA1J
  Top 0.406: IC1.8 13.97,74.93 13.97,49.53 AX1.2
AA2J
  Top 0.406: R1.1 IC1.28
AB1J
  Top 0.406: IC1.7 15.24,76.2 AX1.4
AB2J  (via drill 0.81)
  Top 0.406: IC1.27 17.78,93.98 17.78,105.73 16.83,106.68 5.71,106.68 v5.71,32.07
  Bottom 0.406: v5.71,32.07 6.03,31.75 13.97,31.75 AX2.4
AC1J
  Top 0.406: IC1.6 11.43,80.01 11.43,47.62 12.06,46.99 17.78,46.99 AX1.6
AD1J  (via drill 0.81)
  Top 0.406: IC1.5 10.16,81.28 v10.16,53.02
  Bottom 0.406: v10.16,53.02 10.48,52.7 17.14,52.7 20.32,49.53 AX1.8
AD2J
  Top 0.406: IC1.25 19.05,85.09 19.05,31.75 AX2.8
AE1J  (via drill 0.81)
  Top 0.406: v21.91,85.09 22.86,84.14 AX1.10
  Bottom 0.406: IC1.4 13.97,85.09 v21.91,85.09
AE2J  (via drill 0.81)
  Top 0.406: v8.89,77.47 6.99,75.56 v6.99,33.02
  Bottom 0.406: IC1.24 13.97,77.47 v8.89,77.47 | v6.99,33.02 7.3,32.7 20.64,32.7 AX2.10
AF1J  (via drill 0.81)
  Top 0.406: v21.91,87.63 24.13,85.41 24.13,49.53 AX1.12
  Bottom 0.406: IC1.3 13.97,87.63 v21.91,87.63
AF2J
  Top 0.406: IC1.23 21.59,80.01 21.59,47.62 22.23,46.99 24.13,46.99 24.13,32.38 25.4,31.11 AX2.12
AH1J  (via drill 0.81)
  Top 0.406: v26.67,90.17 27.94,88.9 AX1.14
  Bottom 0.406: IC1.2 13.97,90.17 v26.67,90.17
AH2J  (via drill 0.81)
  Top 0.406: v26.67,73.34 26.67,31.75 AX2.14
  Bottom 0.406: IC1.22 25.72,73.34 v26.67,73.34
AJ1J
  Bottom 0.406: IC1.1 5.4,86.68 5.4,54.29 24.45,54.29 AX1.16
AJ2J  (via drill 0.81)
  Top 0.406: v8.89,29.21 v8.89,74.93
  Bottom 0.406: IC1.21 19.05,74.93 v8.89,74.93 | v8.89,29.21 29.21,29.21 AX2.16
AK1J  (via drill 0.81)
  Top 0.406: v31.75,76.2 31.75,50.16 33.02,48.9 AX1.18
  Bottom 0.406: v31.75,76.2 IC2.8
AK2J  (via drill 0.81)
  Top 0.406: v30.48,74.93 29.21,73.66 29.21,51.44 31.75,48.9 31.75,32.38 33.02,31.11 AX2.18
  Bottom 0.406: IC2.21 41.91,74.93 v30.48,74.93
AL1J
  Top 0.406: IC2.7 34.29,77.47 34.29,49.53 AX1.20
AL2J  (via drill 0.81)
  Top 0.406: v38.1,80.33 36.83,79.06 36.83,31.75 AX2.20
  Bottom 0.406: IC2.22 41.59,80.33 v38.1,80.33
AM1J  (via drill 0.81)
  Top 0.406: AX1.22 v38.1,78.74
  Bottom 0.406: v38.1,78.74 IC2.6
AM2J  (via drill 0.81)
  Top 0.406: v51.75,72.71 52.39,72.07 52.39,56.52 v49.85,53.98 | AX2.22 v38.1,34.92
  Bottom 0.406: v51.75,72.71 IC2.23 | v49.85,53.98 48.58,52.7 35.56,52.7 31.75,48.9 31.75,34.92 v38.1,34.92
AN1J
  Top 0.406: IC2.5 40.01,83.82 40.01,48.9 AX1.24
AN2J
  Top 0.406: IC2.24 44.45,82.55 44.45,29.84 43.81,29.21 40.64,29.21 AX2.24
AP1J  (via drill 0.81)
  Top 0.406: IC2.4 40.96,86.36 40.96,50.8 v41.59,50.16
  Bottom 0.406: v41.59,50.16 43.18,48.58 AX1.26
AP2J
  Top 0.406: IC2.25 41.91,85.09 41.91,51.44 42.86,50.48 42.86,49.85 41.91,48.9 41.91,31.75 AX2.26
AR1J
  Top 0.406: IC2.3 41.91,88.9 41.91,88.58 42.86,87.63 45.72,87.63 AX1.28
AR2J  (via drill 0.81)
  Top 0.406: v47.94,84.14 47.62,83.82 47.62,50.8 49.53,48.9 49.53,34.92 45.72,31.11 AX2.28
  Bottom 0.406: v47.94,84.14 IC2.26
AS1J
  Top 0.406: IC2.2 41.91,91.44 41.91,91.12 42.86,90.17 46.67,90.17 46.67,49.85 AX1.30
AS2J
  Top 0.406: IC2.27 49.21,91.44 49.21,65.72 48.58,65.09 48.58,52.39 52.07,48.9 52.07,34.92 48.26,31.11 AX2.30
AT2J
  Top 0.406: IC2.28 57.15,93.98 57.15,37.47 50.8,31.11 AX2.32
AU1J  (via drill 0.81)
  Top 0.406: v54.61,75.88 53.34,74.61 AX1.34
  Bottom 0.406: IC3.8 58.1,75.88 v54.61,75.88
AU2J  (via drill 0.81)
  Top 0.406: IC3.21 64.45,74.61 64.45,70.48 60.64,66.67 v60.64,30.16
  Bottom 0.406: v60.64,30.16 59.69,29.21 54.61,29.21 AX2.34
AV1J  (via drill 0.81)
  Top 0.406: AX1.36 v55.88,77.47
  Bottom 0.406: IC3.7 57.15,77.47 v55.88,77.47
AV2J  (via drill 0.81)
  Top 0.406: v72.39,78.74 72.71,78.42 72.71,48.9 72.39,48.58 v72.39,31.43
  Bottom 0.406: v72.39,78.74 IC3.22 | v72.39,31.43 56.83,31.43 AX2.36
BA1J  (via drill 0.81)
  Top 0.406: v70.48,82.55 73.66,79.38 v73.66,48.26
  Bottom 0.406: IC3.6 59.69,82.55 v70.48,82.55 | BX1.2 v73.66,48.26
BB1J  (via drill 0.81)
  Top 0.406: v91.12,85.09 91.44,84.77 BX1.4
  Bottom 0.406: IC3.5 59.69,85.09 v91.12,85.09
BB2J  (via drill 0.81)
  Top 0.406: v82.87,80.01 82.55,79.69 v82.55,33.34
  Bottom 0.406: IC3.24 77.15,83.82 80.96,80.01 v82.87,80.01 | v82.55,33.34 84.14,31.75 90.17,31.75 BX2.4
BC1J  (via drill 0.81)
  Top 0.406: v91.76,90.17 93.98,87.95 BX1.6
  Bottom 0.406: IC3.4 62.23,90.17 v91.76,90.17
BD1J  (via drill 0.81)
  Top 0.406: v74.93,46.99 v74.93,76.2
  Bottom 0.406: IC3.3 57.15,87.63 57.15,80.01 63.18,80.01 65.72,77.47 69.85,77.47 71.12,76.2 v74.93,76.2 | v74.93,46.99 75.25,47.31 87.95,47.31 88.27,46.99 95.25,46.99 BX1.8
BD2J  (via drill 0.81)
  Top 0.406: v68.9,86.36 69.22,86.04 v69.22,44.77
  Bottom 0.406: IC3.26 68.58,86.36 v68.9,86.36 | v69.22,44.77 78.42,35.56 92.08,35.56 96.52,31.11 BX2.8
BE1J  (via drill 0.81)
  Top 0.406: v92.08,96.52 95.25,93.34 95.25,52.07 BX1.10
  Bottom 0.406: IC3.2 57.15,92.71 57.15,96.52 v92.08,96.52
BE2J  (via drill 0.81)
  Top 0.406: IC3.27 67.63,89.85 67.63,78.42 68.26,77.79 68.26,46.04 v67.94,45.72
  Bottom 0.406: v67.94,45.72 67.94,38.42 74.3,38.42 78.11,34.61 91.76,34.61 95.25,31.11 95.25,29.21 97.79,29.21 BX2.10
BF1J  (via drill 0.81)
  Top 0.406: v97.16,95.25 99.38,93.03 99.38,50.48 BX1.12
  Bottom 0.406: IC3.1 59.69,95.25 v97.16,95.25
BF2J  (via drill 0.81)
  Top 0.406: IC3.28 64.77,92.71 64.77,78.42 65.72,77.47 67.31,77.47 67.31,49.85 64.14,46.67 v64.14,30.16 | v102.87,22.86 102.87,29.21 BX2.12
  Bottom 0.406: v64.14,30.16 66.67,27.62 70.48,27.62 75.25,22.86 v102.87,22.86
BH1J  (via drill 0.81)
  Top 0.406: IC4.8 80.01,74.93 v80.01,51.12
  Bottom 0.406: v80.01,51.12 81.6,49.53 102.87,49.53 BX1.14
BH2J  (via drill 0.81)
  Top 0.406: v100.65,76.2 101.28,75.56 101.28,50.48 102.87,48.9 102.87,31.75 BX2.14
  Bottom 0.406: v100.65,76.2 IC4.21
BJ1J  (via drill 0.81)
  Top 0.406: v83.82,78.74 84.14,78.42 v84.14,52.07
  Bottom 0.406: v83.82,78.74 IC4.7 | v84.14,52.07 85.72,50.48 104.46,50.48 BX1.16
BJ2J  (via drill 0.81)
  Top 0.406: v71.44,77.47 71.44,32.07 71.12,31.75 v71.12,30.16
  Bottom 0.406: IC4.22 87.63,77.47 v71.44,77.47 | v71.12,30.16 73.34,27.94 87,27.94 89.22,25.72 103.82,25.72 105.41,27.3 105.41,30.48 BX2.16
BK1J  (via drill 0.81)
  Top 0.406: IC4.6 85.41,81.28 v85.41,46.04
  Bottom 0.406: v85.41,46.04 87,44.45 107.31,44.45 107.95,45.09 107.95,48.26 BX1.18
BK2J  (via drill 0.81)
  Top 0.406: v115.57,81.28 115.25,80.96 115.25,49.21 115.57,48.9 115.57,47.62 114.94,46.99 107.95,46.99 107.95,32.38 109.22,31.11 BX2.18
  Bottom 0.406: IC4.23 90.17,82.55 114.3,82.55 v115.57,81.28
BL1J  (via drill 0.81)
  Top 0.406: v109.22,78.74 110.49,77.47 110.49,49.53 BX1.20
  Bottom 0.406: IC4.5 85.09,80.01 107.95,80.01 v109.22,78.74
BL2J  (via drill 0.81)
  Top 0.406: IC4.24 87.63,82.55 87.63,51.44 90.17,48.9 v90.17,24.45
  Bottom 0.406: v90.17,24.45 90.49,24.77 107.95,24.77 110.49,27.3 110.49,30.48 BX2.20
BM1J  (via drill 0.81)
  Top 0.406: v114.62,87.63 114.3,87.31 BX1.22
  Bottom 0.406: IC4.4 82.55,87.63 v114.62,87.63
BM2J  (via drill 0.81)
  Top 0.406: v96.52,53.02 v96.52,86.36 | v113.03,42.86 114.3,41.59 BX2.22
  Bottom 0.406: v96.52,86.36 IC4.25 | v96.52,53.02 96.2,53.34 77.15,53.34 72.39,48.58 72.39,42.86 v113.03,42.86
BN1J  (via drill 0.81)
  Top 0.406: IC4.3 86.68,83.5 v86.68,41.59
  Bottom 0.406: v86.68,41.59 113.35,41.59 115.57,43.81 115.57,48.26 BX1.24
BN2J  (via drill 0.81)
  Top 0.406: IC4.26 87.63,90.17 v87.63,97.79
  Bottom 0.406: v87.63,97.79 88.58,98.74 143.19,98.74 146.37,95.57 146.37,29.21 118.11,29.21 BX2.24
BP1J  (via drill 0.81)
  Top 0.406: v116.84,92.71 116.84,74.61 116.2,73.98 116.2,51.44 BX1.26
  Bottom 0.406: IC4.2 82.55,92.71 v116.84,92.71
BP2J  (via drill 0.81)
  Top 0.406: IC4.27 92.71,87.63 92.71,34.29 91.44,33.02 v91.44,32.7
  Bottom 0.406: v91.44,32.7 92.71,31.43 92.71,26.67 102.23,26.67 102.87,27.3 102.87,31.75 118.11,31.75 BX2.26
BR1J  (via drill 0.81)
  Top 0.406: IC4.1 87.63,87.63 87.63,86.04 88.58,85.09 89.85,85.09 89.85,84.45 90.17,84.14 v90.17,52.07
  Bottom 0.406: v90.17,52.07 90.81,51.44 113.35,51.44 114.3,50.48 124.14,50.48 125.73,48.9 125.73,46.99 123.19,46.99 BX1.28
BR2J
  Bottom 0.406: IC4.28 102.55,93.98 106.36,97.79 142.88,97.79 145.41,95.25 145.41,31.43 133.03,31.43 132.72,31.75 123.19,31.75 BX2.28
BS1J  (via drill 0.81)
  Top 0.406: IC5.8 108.27,72.07 v108.27,50.16
  Bottom 0.406: v108.27,50.16 108.9,49.53 123.19,49.53 BX1.30
BS2J  (via drill 0.81)
  Top 0.406: v117.47,73.66 117.16,73.34 117.16,54.93 123.19,48.9 123.19,32.38 124.46,31.11 BX2.30
  Bottom 0.406: IC5.21 114.3,73.66 v117.47,73.66
BT2J  (via drill 0.81)
  Top 0.406: v121.92,78.42 123.19,77.15 123.19,51.44 125.73,48.9 125.73,32.38 127,31.11 BX2.32
  Bottom 0.406: IC5.22 112.08,78.42 v121.92,78.42
BU1J  (via drill 0.81)
  Top 0.406: v130.81,80.01 130.81,49.53 BX1.34
  Bottom 0.406: IC5.6 104.46,80.96 110.49,80.96 111.44,80.01 v130.81,80.01
BU2J  (via drill 0.81)
  Top 0.406: IC5.23 113.03,80.01 v113.03,53.02 | v128.27,51.44 128.27,33.66 129.54,32.38 BX2.34
  Bottom 0.406: v113.03,53.02 114.62,51.44 v128.27,51.44
BV1J  (via drill 0.81)
  Top 0.406: v138.11,54.29 v138.11,85.09
  Bottom 0.406: IC5.5 105.41,85.09 v138.11,85.09 | BX1.36 v138.11,54.29
BV2J  (via drill 0.81)
  Top 0.406: v133.99,39.05 132.08,37.15 BX2.36
  Bottom 0.406: IC5.24 112.08,83.5 135.57,83.5 139.06,80.01 142.88,80.01 144.46,78.42 144.46,39.05 v133.99,39.05
CLK  (via drill 0.81)
  Top 0.406: PC1.8 140.97,72.39 v140.97,64.45
  Bottom 0.406: IC1.12 13.97,64.77 34.29,64.77 IC2.12 36.83,64.77 48.26,64.77 49.53,66.04 IC3.12 59.69,64.77 80.01,64.77 | IC4.12 80.01,64.77 | 80.01,64.77 89.22,64.77 90.49,66.04 IC5.12 105.41,64.77 140.65,64.77 v140.97,64.45
CS-N  (via drill 0.81)
  Top 0.406: v133.03,69.85 132.08,68.9 v132.08,67.31
  Bottom 0.406: IC1.11 13.97,67.31 34.29,67.31 | IC2.11 34.29,67.31 | 57.15,67.31 IC3.11 | 34.29,67.31 57.15,67.31 | 57.15,67.31 66.36,67.31 67.31,68.26 80.96,68.26 IC4.11 86.36,68.58 87.63,67.31 102.87,67.31 | 102.87,67.31 IC5.11 | PC1.6 138.43,69.85 v133.03,69.85 | 102.87,67.31 v132.08,67.31
GND  (via drill 0.81)
  Top 0.813: 30.48,101.6 C5.2 33.02,96.52 33.18,96.36 | 30.48,101.6 C6.2 | 33.18,96.36 IC2.1 | v33.02,72.39 33.02,96.2 33.18,96.36 | IC1.26 17.78,86.36 17.78,73.03 v16.83,72.07 16.83,51.75 v16.51,51.44 | AX2.6 17.78,38.42 v16.51,39.69 | IC3.10 63.5,76.2 v63.5,86.36 63.5,93.34 71.75,101.6 C3.2 | C4.2 v78.74,71.12 | v54.61,68.58 v54.61,52.07 | v124.46,60.01 127,57.47 BX1.32 | BX2.6 93.98,32.7 v95.25,33.97 | IC5.10 102.55,72.71 102.55,77.15 IC5.7 104.14,79.06 106.68,81.6 106.68,105.41 107.95,106.68 | R12.1 R13.1 142.24,101.6 PC1.25 PC1.23 PC1.21 PC1.19 PC1.17 PC1.15 PC1.13 PC1.11 PC1.9 142.56,76.83 144.78,74.61 144.78,40.01 142.24,37.47 POWER.2 | 107.95,106.68 114.3,106.68 R14.1 | UUT.NC@1 UUT.NC@2 UUT.NC@4 UUT.NC@3 | UUT.NC@5 UUT.NC@6 UUT.NC@7 UUT.NC@8 | GND.1 106.68,144.78 C1.- 106.68,108.27 107.95,107 107.95,106.68 | GNDL0.1 R2.1 | GNDL1.1 R3.1 | GNDL2.1 R4.1 | GNDL3.1 R5.1 43.18,139.38 35.56,131.76 R11.1 30.48,129.54 | 30.48,129.54 R10.1 27.94,134.62 GNDPROBE.1 | 30.48,129.54 30.48,101.6
  Bottom 0.813: IC2.10 33.02,71.12 | 33.02,71.12 C7.2 | v33.02,72.39 33.02,71.12 | IC1.10 13.65,72.07 v16.83,72.07 | v16.51,39.69 11.11,45.09 11.11,51.44 v16.51,51.44 | IC2.1 30.48,88.9 IC1.26 | v63.5,86.36 IC3.25 | C3.2 C4.2 R14.1 C2.2 R12.1 | v78.74,71.12 IC4.10 | v54.61,52.07 AX1.32 | v54.61,68.58 57.15,71.12 IC3.10 | IC6.7 122.87,60.01 v124.46,60.01 | v95.25,33.97 95.89,33.34 126.68,33.34 | 126.68,33.34 142.24,33.34 POWER.1 POWER.2 | BX1.32 131.13,52.39 134.3,52.39 137.48,55.56 138.75,55.56 139.38,54.93 139.38,40.32 133.35,40.32 126.68,33.66 126.68,33.34 | UUT.NC@4 125.73,146.69 UUT.NC@8 | R5.1 R4.1 R3.1 R2.1 | 102.71,148.75 102.55,148.91 90.49,148.91 GNDL0.1 | 102.71,148.75 GND.1 | UUT.NC@3 120.33,148.91 102.87,148.91 102.71,148.75
  pour Bottom (isolate 0.406): 0,0 152.4,0 152.4,152.4 0,152.4
  pour Top (isolate 0.406): 0,0 152.4,0 152.4,152.4 0,152.4
LED0
  Top 0.406: IC5.1 101.28,96.84 101.28,129.86 GREEN.A LED0.1
LED1  (via drill 0.81)
  Top 0.406: v93.98,91.44 90.81,94.61 90.81,125.09 RED1.A LED1.1
  Bottom 0.406: v93.98,91.44 IC5.2
LED2  (via drill 0.81)
  Top 0.406: IC5.3 105.41,90.17 105.41,128.27 97.79,135.89 v97.79,138.75 | LED2.1 YELLOW.A
  Bottom 0.406: v97.79,138.75 90.49,146.05 67.31,146.05 LED2.1
LED3
  Top 0.406: IC5.4 100.33,90.17 100.33,126.68 82.55,144.46 82.55,147.96 81.92,148.59 50.8,148.59 LED3.1 RED2.A
N$1
  Top 0.406: ECS.AA1 EDAC.AA1 DEC.AA1 13.97,14.29 13.97,31.11 14.29,31.43 14.29,44.13 AX1.1
N$2  (via drill 0.81)
  Top 0.406: v68.58,34.61 EDAC.AV1 ECS.AV1
  Bottom 0.406: AX1.35 58.42,43.18 60.01,43.18 v68.58,34.61
N$3  (via drill 0.81)
  Top 0.406: ECS.AU1 EDAC.AU1 DEC.AU1 v65.41,36.2
  Bottom 0.406: AX1.33 56.83,42.23 59.37,42.23 v65.41,36.2
N$4  (via drill 0.81)
  Top 0.406: v62.23,37.78 EDAC.AT1 ECS.AT1
  Bottom 0.406: AX1.31 55.24,41.27 58.74,41.27 v62.23,37.78
N$5  (via drill 0.81)
  Top 0.406: ECS.AS1 EDAC.AS1 DEC.AS1 59.05,39.37 v58.42,40.01
  Bottom 0.406: AX1.29 53.98,40.01 v58.42,40.01
N$6  (via drill 0.81)
  Top 0.406: AX1.27 48.26,43.18 v48.26,36.51 | v57.78,36.51 57.78,14.29 55.88,12.38 EDAC.AR1 ECS.AR1
  Bottom 0.406: v57.78,36.51 v48.26,36.51
N$7  (via drill 0.81)
  Top 0.406: ECS.AP1 EDAC.AP1 DEC.AP1 54.61,15.56 54.61,32.07 v56.52,33.97
  Bottom 0.406: AX1.25 49.85,39.05 56.83,39.05 59.05,36.83 59.05,33.97 v56.52,33.97
N$8  (via drill 0.81)
  Top 0.406: v53.34,37.78 53.02,37.47 53.02,34.61 49.53,31.11 EDAC.AN1 ECS.AN1
  Bottom 0.406: AX1.23 48.58,37.78 v53.34,37.78
N$9  (via drill 0.81)
  Top 0.406: DEC.AM1 EDAC.AM1 ECS.AM1 47.31,9.53 47.31,8.89 65.72,8.89 66.99,10.16 66.99,13.97 66.67,14.29 66.67,46.35 v66.04,46.99
  Bottom 0.406: AX1.21 39.37,46.99 v66.04,46.99
N$10  (via drill 0.81)
  Top 0.406: v50.8,35.24 50.48,34.92 50.48,34.61 46.99,31.11 46.99,16.19 43.18,12.38 EDAC.AL1 ECS.AL1
  Bottom 0.406: AX1.19 39.69,41.59 39.69,35.24 v50.8,35.24
N$11  (via drill 0.81)
  Top 0.406: ECS.AK1 EDAC.AK1 DEC.AK1 39.37,14.29 39.37,39.37 v38.42,40.32
  Bottom 0.406: v38.42,40.32 AX1.17
N$12
  Top 0.406: AX1.15 30.8,45.4 30.8,32.07 31.75,31.11 31.75,29.84 32.38,29.21 36.83,29.21 EDAC.AJ1 ECS.AJ1
N$13  (via drill 0.81)
  Top 0.406: ECS.AH1 EDAC.AH1 DEC.AH1 | v27.94,33.34 AX1.13
  Bottom 0.406: v27.94,33.34 29.53,31.75 31.11,31.75 31.75,31.11 31.75,13.97 33.34,13.97 DEC.AH1
N$14  (via drill 0.81)
  Top 0.406: v29.21,41.91 29.21,14.92 30.48,13.65 EDAC.AF1 ECS.AF1
  Bottom 0.406: v29.21,41.91 AX1.11
N$15
  Top 0.406: ECS.AE1 EDAC.AE1 DEC.AE1 24.13,16.83 24.13,31.11 23.18,32.07 23.18,45.4 AX1.9
N$16
  Top 0.406: AX1.7 21.59,44.45 21.59,16.19 24.13,13.65 EDAC.AD1 ECS.AD1
N$17  (via drill 0.81)
  Top 0.406: DEC.AC1 EDAC.AC1 ECS.AC1 20.95,9.21 22.54,7.62 22.54,2.54 15.88,2.54 11.43,6.99 11.43,33.66 v13.02,35.24
  Bottom 0.406: AX1.5 17.78,35.24 v13.02,35.24
N$18
  Top 0.406: AX1.3 15.24,32.38 16.51,31.11 16.51,14.92 17.78,13.65 EDAC.AB1 ECS.AB1
N$19
  Top 0.406: ECS.AA2 EDAC.AA2
  Bottom 0.406: AX2.1 12.7,7.3 ECS.AA2
N$20
  Top 0.406: DEC.AB2 EDAC.AB2 ECS.AB2 16.19,8.89 16.19,13.97 15.56,14.61 15.56,27.62 AX2.3
N$21
  Top 0.406: AX2.5 19.37,26.35 19.37,8.89 ECS.AC2 EDAC.AC2
N$22
  Top 0.406: DEC.AD2 EDAC.AD2 ECS.AD2 22.54,8.89 22.54,13.97 20.64,15.88 20.64,27.62 AX2.7
N$23
  Top 0.406: AX2.9 23.18,27.62 23.18,15.88 25.72,13.34 25.72,8.89 ECS.AE2 EDAC.AE2
N$24
  Top 0.406: DEC.AF2 EDAC.AF2 ECS.AF2 28.89,8.89 28.89,13.97 28.26,14.61 28.26,25.08 AX2.11
N$25
  Top 0.406: ECS.AH2 EDAC.AH2
  Bottom 0.406: AX2.13 27.94,14.92 29.53,14.92 32.07,12.38 32.07,7.3 ECS.AH2
N$26
  Top 0.406: DEC.AJ2 EDAC.AJ2 ECS.AJ2 35.24,8.89 35.24,23.18 AX2.15
N$27
  Top 0.406: ECS.AK2 EDAC.AK2
  Bottom 0.406: AX2.17 33.02,15.56 33.66,15.56 35.24,13.97 35.24,8.89 37.15,8.89 38.73,7.3 ECS.AK2
N$28
  Top 0.406: DEC.AL2 EDAC.AL2 ECS.AL2
  Bottom 0.406: AX2.19 35.56,14.92 35.88,14.92 38.42,12.38 38.42,8.89 41.59,8.89 ECS.AL2
N$29
  Top 0.406: AX2.21 38.42,27.62 38.42,10.16 39.69,8.89 46.35,8.89 ECS.AM2 EDAC.AM2
N$30
  Top 0.406: DEC.AN2 EDAC.AN2 ECS.AN2
  Bottom 0.406: AX2.23 40.64,16.19 40.96,16.19 44.77,12.38 44.77,8.89 47.94,8.89 ECS.AN2
N$31
  Top 0.406: ECS.AP2 EDAC.AP2
  Bottom 0.406: AX2.25 51.12,20 51.12,7.3 ECS.AP2
N$32
  Top 0.406: DEC.AR2 EDAC.AR2 ECS.AR2
  Bottom 0.406: AX2.27 54.29,19.37 54.29,7.3 ECS.AR2
N$33
  Top 0.406: ECS.AS2 EDAC.AS2
  Bottom 0.406: AX2.29 57.47,18.73 57.47,7.3 ECS.AS2
N$34
  Top 0.406: DEC.AT2 EDAC.AT2 ECS.AT2
  Bottom 0.406: AX2.31 60.64,18.1 60.64,7.3 ECS.AT2
N$35
  Top 0.406: ECS.AU2 EDAC.AU2
  Bottom 0.406: AX2.33 63.82,17.46 63.82,7.3 ECS.AU2
N$36
  Top 0.406: DEC.AV2 EDAC.AV2 ECS.AV2
  Bottom 0.406: AX2.35 62.87,20.95 63.82,20.95 66.99,17.78 66.99,7.3 ECS.AV2
N$37  (via drill 0.81)
  Top 0.406: v88.9,15.24 BX2.1 | ECS.BA2 EDAC.BA2
  Bottom 0.406: v88.9,15.24 86.04,12.38 86.04,7.3 ECS.BA2
N$38
  Top 0.406: DEC.BB2 EDAC.BB2 ECS.BB2 89.22,8.89 89.22,13.97 91.44,16.19 BX2.3
N$39
  Top 0.406: BX2.5 93.66,27.62 93.66,14.61 92.39,13.34 92.39,8.89 ECS.BC2 EDAC.BC2
N$40
  Top 0.406: DEC.BD2 EDAC.BD2 ECS.BD2 95.57,8.89 95.57,13.97 96.2,14.61 96.2,27.62 BX2.7
N$41
  Top 0.406: BX2.9 98.74,27.62 98.74,8.89 ECS.BE2 EDAC.BE2
N$42  (via drill 0.81)
  Top 0.406: DEC.BF2 EDAC.BF2 ECS.BF2 | v101.6,15.24 BX2.11
  Bottom 0.406: v101.6,15.24 98.74,12.38 98.74,7.3 ECS.BF2
N$43
  Top 0.406: BX2.13 104.14,16.19 101.92,13.97 101.92,8.89 ECS.BH2 EDAC.BH2
N$44
  Top 0.406: DEC.BJ2 EDAC.BJ2 ECS.BJ2 105.09,8.89 105.09,12.38 106.36,13.65 106.36,27.62 BX2.15
N$45
  Top 0.406: BX2.17 109.22,16.19 111.44,13.97 111.44,8.89 ECS.BK2 EDAC.BK2
N$46
  Top 0.406: DEC.BL2 EDAC.BL2 ECS.BL2
  Bottom 0.406: BX2.19 111.76,12.7 111.44,12.38 111.44,7.3 ECS.BL2
N$47
  Top 0.406: BX2.21 114.62,27.62 114.62,8.89 ECS.BM2 EDAC.BM2
N$48
  Top 0.406: DEC.BN2 EDAC.BN2 ECS.BN2 117.79,8.89 117.79,13.97 117.16,14.61 117.16,27.62 BX2.23
N$49
  Top 0.406: BX2.25 119.7,27.62 119.7,14.61 120.97,13.34 120.97,8.89 ECS.BP2 EDAC.BP2
N$50
  Top 0.406: DEC.BR2 EDAC.BR2 ECS.BR2 124.14,8.89 124.14,13.97 122.24,15.88 122.24,27.62 BX2.27
N$51
  Top 0.406: BX2.29 124.78,27.62 124.78,15.88 127.32,13.34 127.32,8.89 ECS.BS2 EDAC.BS2
N$52
  Top 0.406: DEC.BT2 EDAC.BT2 ECS.BT2
  Bottom 0.406: BX2.31 127,26.67 130.49,23.18 130.49,7.3 ECS.BT2
N$53
  Top 0.406: BX2.33 133.67,23.81 133.67,8.89 ECS.BU2 EDAC.BU2
N$54
  Top 0.406: DEC.BV2 EDAC.BV2 ECS.BV2
  Bottom 0.406: BX2.35 140.02,20 140.02,7.3 ECS.BV2
N$55
  Top 0.406: ECS.BA1 EDAC.BA1 DEC.BA1 84.45,33.97 87.95,37.47 87.95,44.77 BX1.1
N$56  (via drill 0.81)
  Top 0.406: v91.44,39.37 BX1.3 | v88.9,36.83 87.63,35.56 EDAC.BB1 ECS.BB1
  Bottom 0.406: v88.9,36.83 v91.44,39.37
N$57
  Top 0.406: ECS.BC1 EDAC.BC1 DEC.BC1 92.71,15.56 92.71,33.02 93.66,33.97 93.66,45.4 BX1.5
N$58
  Top 0.406: BX1.7 96.52,32.38 95.25,31.11 95.25,14.92 93.98,13.65 EDAC.BD1 ECS.BD1
N$59
  Top 0.406: ECS.BE1 EDAC.BE1 DEC.BE1 97.79,14.29 97.79,44.45 BX1.9
N$60
  Top 0.406: BX1.11 100.33,44.45 EDAC.BF1 ECS.BF1
N$61
  Top 0.406: ECS.BH1 EDAC.BH1 DEC.BH1 105.41,15.56 105.41,44.45 BX1.13
N$62
  Top 0.406: BX1.15 107,45.4 107,32.07 107.95,31.11 107.95,13.34 EDAC.BJ1 ECS.BJ1
N$63  (via drill 0.81)
  Top 0.406: ECS.BK1 EDAC.BK1 DEC.BK1 | BX1.17 110.49,44.45 v110.49,16.51
  Bottom 0.406: v110.49,16.51 110.49,13.65 DEC.BK1
N$64
  Top 0.406: BX1.19 111.76,32.38 113.03,31.11 EDAC.BL1 ECS.BL1
N$65
  Top 0.406: ECS.BM1 EDAC.BM1 DEC.BM1 115.57,14.29 115.57,44.45 BX1.21
N$66
  Top 0.406: BX1.23 118.11,44.45 118.11,14.92 119.38,13.65 EDAC.BN1 ECS.BN1
N$67
  Top 0.406: ECS.BP1 EDAC.BP1 DEC.BP1 120.65,15.56 120.65,44.45 BX1.25
N$68
  Top 0.406: BX1.27 122.24,45.4 122.24,32.07 123.19,31.11 123.19,16.19 125.73,13.65 EDAC.BR1 ECS.BR1
N$69
  Top 0.406: ECS.BS1 EDAC.BS1 DEC.BS1 125.73,16.83 125.73,31.11 124.78,32.07 124.78,45.4 BX1.29
N$70
  Top 0.406: BX1.31 127.32,45.4 127.32,32.07 128.27,31.11 128.27,16.19 132.08,12.38 EDAC.BT1 ECS.BT1
N$71
  Top 0.406: ECS.BU1 EDAC.BU1 DEC.BU1 135.25,40.01 BX1.33
N$72
  Top 0.406: BX1.35 138.43,39.37 EDAC.BV1 ECS.BV1
N$73
  Bottom 0.406: R2.2 91.44,132.08 GREEN.K
N$74
  Bottom 0.406: R3.2 76.2,132.08 RED1.K
N$75
  Bottom 0.406: R4.2 60.96,132.08 YELLOW.K
N$76
  Bottom 0.406: R5.2 45.72,132.08 RED2.K
N$77
  Top 0.406: R7.1 R6.1 LOADL3.1
N$78
  Top 0.406: R9.1 R8.1 LOADL1.1
N$79
  Top 0.406: LOADHI1.1 R11.2
N$80
  Top 0.406: LOADHI3.1 R10.2
N$81
  Top 0.406: D1.C D2.A
N$82
  Top 0.406: R12.2 R13.2 134.62,127 UUT_PWR.K
N$83
  Bottom 0.406: R14.2 116.84,109.22 PWR.K
PROBE1  (via drill 0.81)
  Top 0.406: IC5.25 115.57,90.17 v115.57,105.41
  Bottom 0.406: v115.57,105.41 98.11,122.87 11.75,122.87 PROBE1.1
PROBE2  (via drill 0.81)
  Top 0.406: IC5.26 113.98,91.12 113.98,100.33 109.54,104.78 v109.54,105.41
  Bottom 0.406: v109.54,105.41 95.57,119.38 PROBE2.1
PROBE3  (via drill 0.81)
  Top 0.406: IC5.27 113.03,92.71 113.03,99.69 v107.95,104.78
  Bottom 0.406: v107.95,104.78 100.97,111.76 PROBE3.1
PROBE4  (via drill 0.81)
  Top 0.406: IC5.28 109.22,96.52 v109.22,100.01
  Bottom 0.406: v109.22,100.01 108.9,100.33 11.43,100.33 PROBE4.1
RESET-N
  Top 0.406: IC3.15 IC3.16 IC3.17 IC3.18 | IC1.15 IC1.16 IC1.17 IC1.18 | IC2.15 IC2.16 IC2.17 IC2.18 | IC4.15 IC4.16 IC4.17 IC4.18 | IC5.15 IC5.16 IC5.17 IC5.18
  Bottom 0.406: IC1.15 21.59,62.23 41.59,62.23 42.86,60.96 IC2.15 47.31,60.96 48.58,62.23 64.77,62.23 IC3.15 | PC1.4 131.13,68.58 129.86,69.85 121.6,69.85 120.33,68.58 IC5.18 | IC4.15 89.22,61.28 102.87,61.28 103.82,62.23 110.17,62.23 111.44,60.96 IC5.15 | IC3.17 66.36,66.36 80.01,66.36 80.96,67.31 86.36,67.31 87.63,66.04 IC4.17
SI-A
  Bottom 0.406: IC1.13 20.95,55.24 58.42,55.24 59.37,54.29 118.75,54.29 119.38,53.66 133.67,53.66 143.51,63.5 143.51,74.93 140.97,74.93 PC1.10
SI-B  (via drill 0.81)
  Top 0.406: v49.85,64.77 51.12,66.04 v51.12,68.58
  Bottom 0.406: IC2.13 35.88,63.18 41.91,63.18 42.86,62.23 47.31,62.23 v49.85,64.77 | v51.12,68.58 54.93,72.39 119.06,72.39 121.6,74.93 135.89,74.93 PC1.12
SI-C  (via drill 0.81)
  Top 0.406: IC3.13 59.69,62.23 59.69,58.74 v59.37,58.42 | v140.97,62.87 143.51,65.41 143.51,74.3 142.88,74.93 140.97,74.93 140.97,80.01 PC1.14
  Bottom 0.406: v59.37,58.42 62.55,55.24 119.06,55.24 119.7,54.61 132.72,54.61 v140.97,62.87
SI-D  (via drill 0.81)
  Top 0.406: v97.79,64.77 98.11,65.09 v98.11,88.9
  Bottom 0.406: IC4.13 82.55,62.23 95.25,62.23 v97.79,64.77 | v98.11,88.9 99.38,90.17 122.56,90.17 125.41,87.31 138.75,87.31 139.06,87.63 140.34,87.63 140.97,87 140.97,83.82 PC1.16
SI-E  (via drill 0.81)
  Top 0.406: v118.43,62.23 119.7,63.5 v119.7,86.36
  Bottom 0.406: IC5.13 104.46,63.18 110.49,63.18 111.44,62.23 v118.43,62.23 | PC1.18 v119.7,86.36
SO-A
  Bottom 0.406: IC1.14 11.43,62.23 11.43,69.85 50.48,69.85 55.56,74.93 101.28,74.93 103.82,77.47 120.65,77.47 IC6.1
SO-AN
  Bottom 0.406: IC6.2 123.19,72.39 140.34,72.39 140.97,71.75 140.97,68.58 PC1.3
SO-B  (via drill 0.81)
  Top 0.406: v61.91,59.69 64.14,61.91 v64.14,68.58
  Bottom 0.406: IC2.14 36.83,59.69 v61.91,59.69 | v64.14,68.58 65.41,69.85 120.33,69.85 121.6,71.12 IC6.3
SO-BN  (via drill 0.81)
  Top 0.406: IC6.4 120.65,69.85 120.65,83.5 v125.73,88.58
  Bottom 0.406: v125.73,88.58 133.67,96.52 PC1.26
SO-C  (via drill 0.81)
  Top 0.406: v120.02,55.88 120.65,56.52 120.65,64.77 IC6.5
  Bottom 0.406: IC3.14 64.45,60.96 69.22,56.2 119.7,56.2 v120.02,55.88
SO-CN  (via drill 0.81)
  Top 0.406: v124.46,63.5 124.78,63.82 124.78,72.39 128.27,75.88 128.27,90.17 132.08,93.98 PC1.24
  Bottom 0.406: v124.46,63.5 IC6.6
SO-D
  Bottom 0.406: IC4.14 83.5,58.74 126.36,58.74 128.27,60.64 128.27,63.5 IC6.9
SO-DN  (via drill 0.81)
  Top 0.406: v132.08,63.5 134.3,65.72 v134.3,88.58
  Bottom 0.406: v132.08,63.5 IC6.8 | v134.3,88.58 134.62,88.9 PC1.20
SO-E  (via drill 0.81)
  Top 0.406: v126.05,62.23 128.27,64.45 128.27,67.31 IC6.11
  Bottom 0.406: IC5.14 105.41,59.69 119.06,59.69 121.6,62.23 v126.05,62.23
SO-EN  (via drill 0.81)
  Top 0.406: v136.84,66.04 136.84,88.58 PC1.22
  Bottom 0.406: v136.84,66.04 IC6.10
VCC  (via drill 0.81)
  Top 0.813: R6.2 R7.2 R8.2 R9.2 | v127,78.74 D1.A 127,107 128.59,108.58 128.59,140.02 UUT.2 | IC6.14 129.54,89.85 134.94,89.85 135.57,89.22 135.57,47.94 142.24,41.27 POWER.3
  Bottom 0.813: v127,78.74 IC6.14 | R9.2 30.8,137.48 126.05,137.48 UUT.2
VDD  (via drill 0.81)
  Top 0.813: v16.51,101.6 v16.51,73.66 | C7.1 25.4,104.14 C6.1 | v77.47,73.66 77.47,100.97 77.15,101.28 77.15,105.09 C4.1 | IC3.9 62.23,77.47 62.23,95.25 | C3.1 62.23,95.25 | D2.C 121.76,109.38 | 121.76,109.38 PWR.A | v106.68,76.2 107.95,77.47 v107.95,102.87 | 121.76,109.38 119.38,107 C2.1 | C5.1 44.13,95.57 62.23,95.57 62.23,95.25
  Bottom 0.813: C7.1 26.35,72.07 29.53,72.07 31.11,73.66 IC2.9 | v16.51,73.66 IC1.9 | v16.51,101.6 21.59,106.68 C6.1 C5.1 | v77.47,73.66 IC4.9 | C3.1 C4.1 79.06,106.68 82.87,102.87 v107.95,102.87 109.22,104.14 116.84,104.14 C2.1 | v106.68,76.2 IC5.9
VPP  (via drill 0.81)
  Top 0.813: UUT_PWR.A 136.84,132.4 136.84,143.51 UUT.3 | C1.+ VPP.1 | 75.09,79.53 76.2,78.42 v76.2,34.92 | 75.09,79.53 v74.61,80.01 | v89.53,124.14 75.25,109.86 75.25,79.69 75.09,79.53
  Bottom 0.813: R1.2 10.16,93.03 4.13,87 4.13,34.29 | 4.13,34.29 4.13,30.48 AX2.2 | UUT_PWR.A 134.62,129.54 C1.+ 111.44,129.54 106.05,124.14 v89.53,124.14 | IC3.23 67.31,80.01 v74.61,80.01 | 78.26,32.86 80.64,30.48 BX2.2 | 78.26,32.86 v76.2,34.92 | 4.13,34.29 12.06,34.29 12.38,33.97 26.67,33.97 27.3,34.61 30.48,34.61 32.38,32.7 78.11,32.7 78.26,32.86

### Text on the board
tPlace: Design by Warren Stearns | M-Series Flip-Chip Tester | AA | AV | BA | BV